# EAGLE schematic PixHawk_Fire_v1.3 (EAGLE 6.6.0)

## Sheet 1 of 9
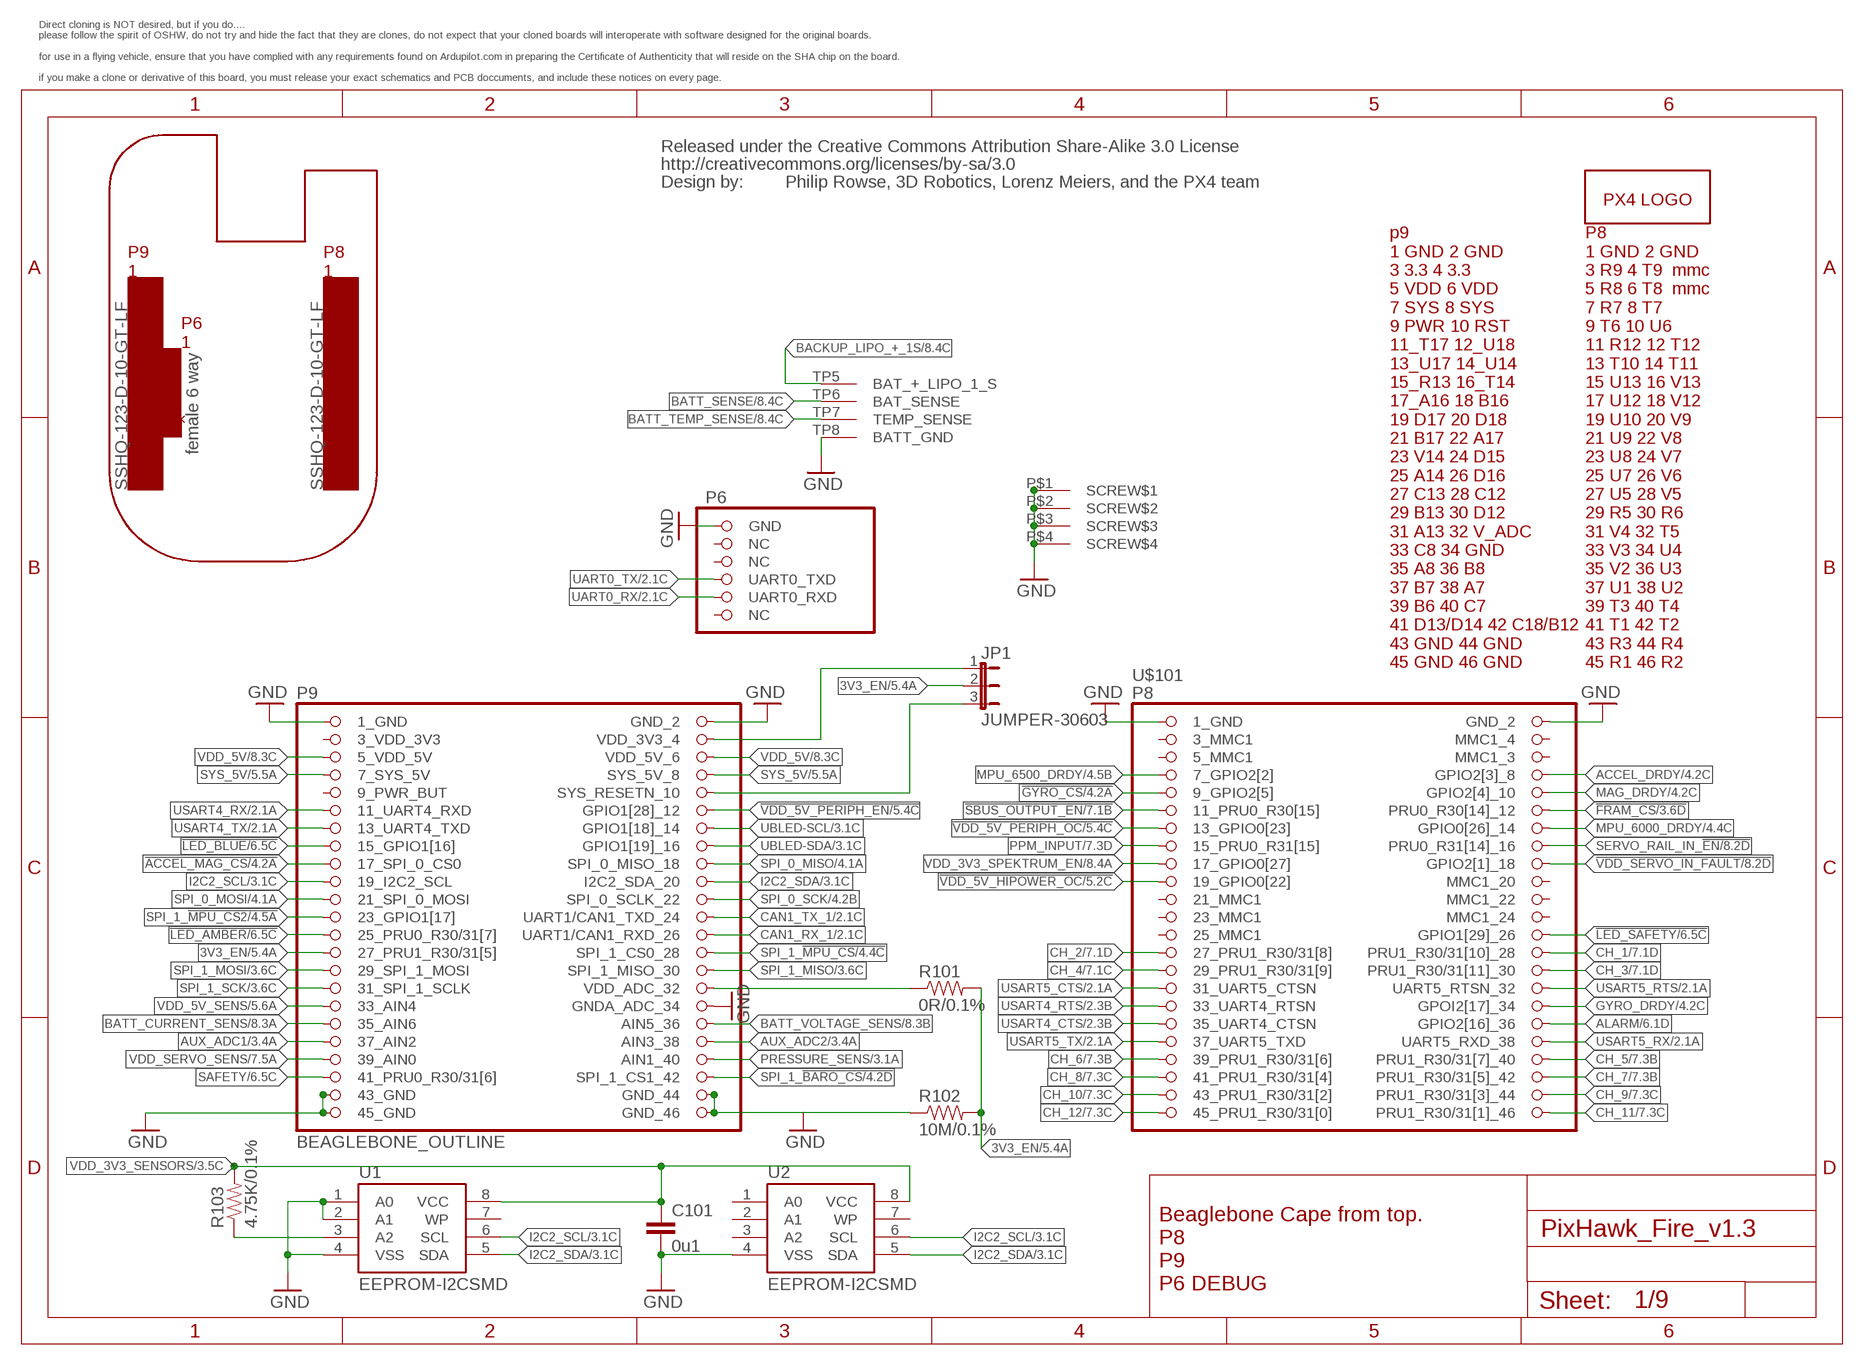
[diagram p0: schematic, sheet 1]
U$16 (NOT-CONNECTED): PARTNO: SSHQ-123-D-10-GT-LF
U$17 (NOT-CONNECTED): PARTNO: SSHQ-123-D-10-GT-LF
U$18 (NOT-CONNECTED): PARTNO: female 6 way

### Parts
C101  0u1  CAP0402  [0402-CAP]
JP1  JUMPER-30603  [SJ_3_0603_PASTE1&2]
R101  0R/0.1%  RESISTOR0402-RES  [0402-RES]
R102  10M/0.1%  RESISTOR0402-RES  [0402-RES]
R103  4.75K/0.1%  RESISTOR0402-RES  [0402-RES]
U1  EEPROM-I2CSMD  [SO08]
U2  EEPROM-I2CSMD  [SO08]
U$1  PX4-LOGO  [PIXHAWK-FIRE-LOGO-30]
U$6  CREATIVE_COMMONS  [CREATIVE_COMMONS]
U$101  BEAGLEBONE_OUTLINE  [BEAGLEBONE_SHIELD]

### Nets
3V3_EN [power]: JP1.2 R101.P$2 R102.P$2 U$101.73(27_PRU1_R30/31[5]) ; also sheet 5
!ACCEL_MAG_CS: U$101.63(17_SPI_0_CS0) ; also sheet 4
!FRAM_CS: U$101.12(PRU0_R30[14]_12) ; also sheet 3
!GYRO_CS: U$101.9(9_GPIO2[5]) ; also sheet 4
!LED_AMBER: U$101.71(25_PRU0_R30/31[7]) ; also sheet 6
!LED_BLUE: U$101.61(15_GPIO1[16]) ; also sheet 6
!LED_SAFETY: U$101.26(GPIO1[29]_26) ; also sheet 6
!SBUS_OUTPUT_EN: U$101.11(11_PRU0_R30[15]) ; also sheet 7
!VDD_5V_HIPOWER_OC: U$101.19(19_GPIO0[22]) ; also sheet 5
!VDD_5V_PERIPH_EN: U$101.58(GPIO1[28]_12) ; also sheet 5
!VDD_5V_PERIPH_OC: U$101.13(13_GPIO0[23]) ; also sheet 5
!VDD_SERVO_IN_FAULT: U$101.18(GPIO2[1]_18) ; also sheet 8
ACCEL_DRDY: U$101.8(GPIO2[3]_8) ; also sheet 4
ALARM: U$101.36(GPIO2[16]_36) ; also sheet 6
AUX_ADC1: U$101.83(37_AIN2) ; also sheet 3
AUX_ADC2: U$101.84(AIN3_38) ; also sheet 3
BACKUP_LIPO_+_1S: U$101.TP5(BAT_+_LIPO_1_S) ; also sheet 8
BATT_CURRENT_SENS: U$101.81(35_AIN6) ; also sheet 8
BATT_SENSE: U$101.TP6(BAT_SENSE) ; also sheet 8
BATT_TEMP_SENSE: U$101.TP7(TEMP_SENSE) ; also sheet 8
BATT_VOLTAGE_SENS: U$101.82(AIN5_36) ; also sheet 8
CH_1: U$101.28(PRU1_R30/31[10]_28) ; also sheet 7
CH_2: U$101.27(27_PRU1_R30/31[8]) ; also sheet 7
CH_3: U$101.30(PRU1_R30/31[11]_30) ; also sheet 7
CH_4: U$101.29(29_PRU1_R30/31[9]) ; also sheet 7
CH_5: U$101.40(PRU1_R30/31[7]_40) ; also sheet 7
CH_6: U$101.39(39_PRU1_R30/31[6]) ; also sheet 7
CH_7: U$101.42(PRU1_R30/31[5]_42) ; also sheet 7
CH_8: U$101.41(41_PRU1_R30/31[4]) ; also sheet 7
CH_9: U$101.44(PRU1_R30/31[3]_44) ; also sheet 7
CH_10: U$101.43(43_PRU1_R30/31[2]) ; also sheet 7
CH_11: U$101.46(PRU1_R30/31[1]_46) ; also sheet 7
CH_12: U$101.45(45_PRU1_R30/31[0]) ; also sheet 7
GND [power]: C101.P$2 R102.P$1 U1.1(A0) U1.2(A1) U1.4(VSS) U2.4(VSS) U$101.1(1_GND) U$101.2(GND_2) U$101.47(1_GND) U$101.48(GND_2) U$101.80(GNDA_ADC_34) U$101.89(43_GND) U$101.90(GND_44) U$101.91(45_GND) U$101.92(GND_46) U$101.93(GND) U$101.P$1(SCREW$1) U$101.P$2(SCREW$2) U$101.P$3(SCREW$3) U$101.P$4(SCREW$4) U$101.TP8(BATT_GND) ; also sheet 2,3,4,5,6,7,8,9
GYRO_DRDY: U$101.34(GPOI2[17]_34) ; also sheet 4
I2C2_SCL: U1.6(SCL) U2.6(SCL) U$101.65(19_I2C2_SCL) ; also sheet 3,4,6
I2C2_SDA: U1.5(SDA) U2.5(SDA) U$101.66(I2C2_SDA_20) ; also sheet 3,4,6
MAG_DRDY: U$101.10(GPIO2[4]_10) ; also sheet 4
MPU_6000_DRDY [power]: U$101.14(GPIO0[26]_14) ; also sheet 4
MPU_6500_DRDY: U$101.7(7_GPIO2[2]) ; also sheet 4
N$43: R103.P$1 U1.3(A2)
N$58: JP1.1 U$101.50(VDD_3V3_4)
N$59: JP1.3 U$101.56(SYS_RESETN_10)
PPM_INPUT: U$101.15(15_PRU0_R31[15]) ; also sheet 7
PRESSURE_SENS: U$101.86(AIN1_40) ; also sheet 3
SAFETY: U$101.87(41_PRU0_R30/31[6]) ; also sheet 6
SERVO_RAIL_IN_!EN: U$101.16(PRU0_R31[14]_16) ; also sheet 8
SPI_0_MISO: U$101.64(SPI_0_MISO_18) ; also sheet 4
SPI_0_MOSI: U$101.67(21_SPI_0_MOSI) ; also sheet 4
SPI_0_SCK: U$101.68(SPI_0_SCLK_22) ; also sheet 4
SPI_1_!BARO_CS: U$101.88(SPI_1_CS1_42) ; also sheet 4
SPI_1_!MPU_CS: U$101.74(SPI_1_CS0_28) ; also sheet 4
SPI_1_!MPU_CS2: U$101.69(23_GPIO1[17]) ; also sheet 4
SPI_1_MISO: U$101.76(SPI_1_MISO_30) ; also sheet 3,4
SPI_1_MOSI: U$101.75(29_SPI_1_MOSI) ; also sheet 3,4
SPI_1_SCK: U$101.77(31_SPI_1_SCLK) ; also sheet 3,4
SYS_5V: U$101.53(7_SYS_5V) U$101.54(SYS_5V_8) ; also sheet 5,7,8,9
UART0_RX: U$101.97(UART0_RXD) ; also sheet 2
UART0_TX: U$101.96(UART0_TXD) ; also sheet 2
UBLED-SCL: U$101.60(GPIO1[18]_14) ; also sheet 3
UBLED-SDA: U$101.62(GPIO1[19]_16) ; also sheet 3
USART4_CTS: U$101.35(35_UART4_CTSN) ; also sheet 2
USART4_RTS: U$101.33(33_UART4_RTSN) ; also sheet 2
USART4_RX: U$101.57(11_UART4_RXD) ; also sheet 2
USART4_TX: U$101.59(13_UART4_TXD) ; also sheet 2
USART5_CTS: U$101.31(31_UART5_CTSN) ; also sheet 2
USART5_RTS: U$101.32(UART5_RTSN_32) ; also sheet 2
USART5_RX: U$101.38(UART5_RXD_38) ; also sheet 2
USART5_TX: U$101.37(37_UART5_TXD) ; also sheet 2
VDD_3V3_SENSORS [power]: C101.P$1 R103.P$2 U1.8(VCC) U2.8(VCC) ; also sheet 3,4,5,9
VDD_3V3_SPEKTRUM_EN: U$101.17(17_GPIO0[27]) ; also sheet 8
VDD_5V: U$101.51(5_VDD_5V) U$101.52(VDD_5V_6) ; also sheet 8
VDD_5V_SENS: U$101.79(33_AIN4) ; also sheet 5
VDD_ADC: R101.P$1 U$101.78(VDD_ADC_32)
VDD_SERVO_SENS: U$101.85(39_AIN0) ; also sheet 7
Unconnected: U1.7(WP) U2.1(A0) U2.2(A1) U2.3(A2) U2.7(WP) U$101.3(3_MMC1) U$101.4(MMC1_4) U$101.5(5_MMC1) U$101.6(MMC1_3) U$101.20(MMC1_20) U$101.21(21_MMC1) U$101.22(MMC1_22) U$101.23(23_MMC1) U$101.24(MMC1_24) U$101.25(25_MMC1) U$101.55(9_PWR_BUT) U$101.70(UART1/CAN1_TXD_24) U$101.72(UART1/CAN1_RXD_26) U$101.94(NC) U$101.95(NC) U$101.98(NC)

### Notes on the sheet
- Direct cloning is NOT desired, but if you do....
  please follow the spirit of OSHW, do not try and hide the fact that they are clones, do not expect that your cloned boards will interoperate with software designed for the original boards.
  
  for use in a flying vehicle, ensure that you have complied with any requirements found on Ardupilot.com in preparing the Certificate of Authenticity that will reside on the SHA chip on the board.
  
  if you make a clone or derivative of this board, you must release your exact schematics and PCB doccuments, and include these notices on every page.
- Philip Rowse, 3D Robotics, Lorenz Meiers, and the PX4 team
- Beaglebone Cape from top.
  P8
  P9
  P6 DEBUG

## Sheet 2 of 9
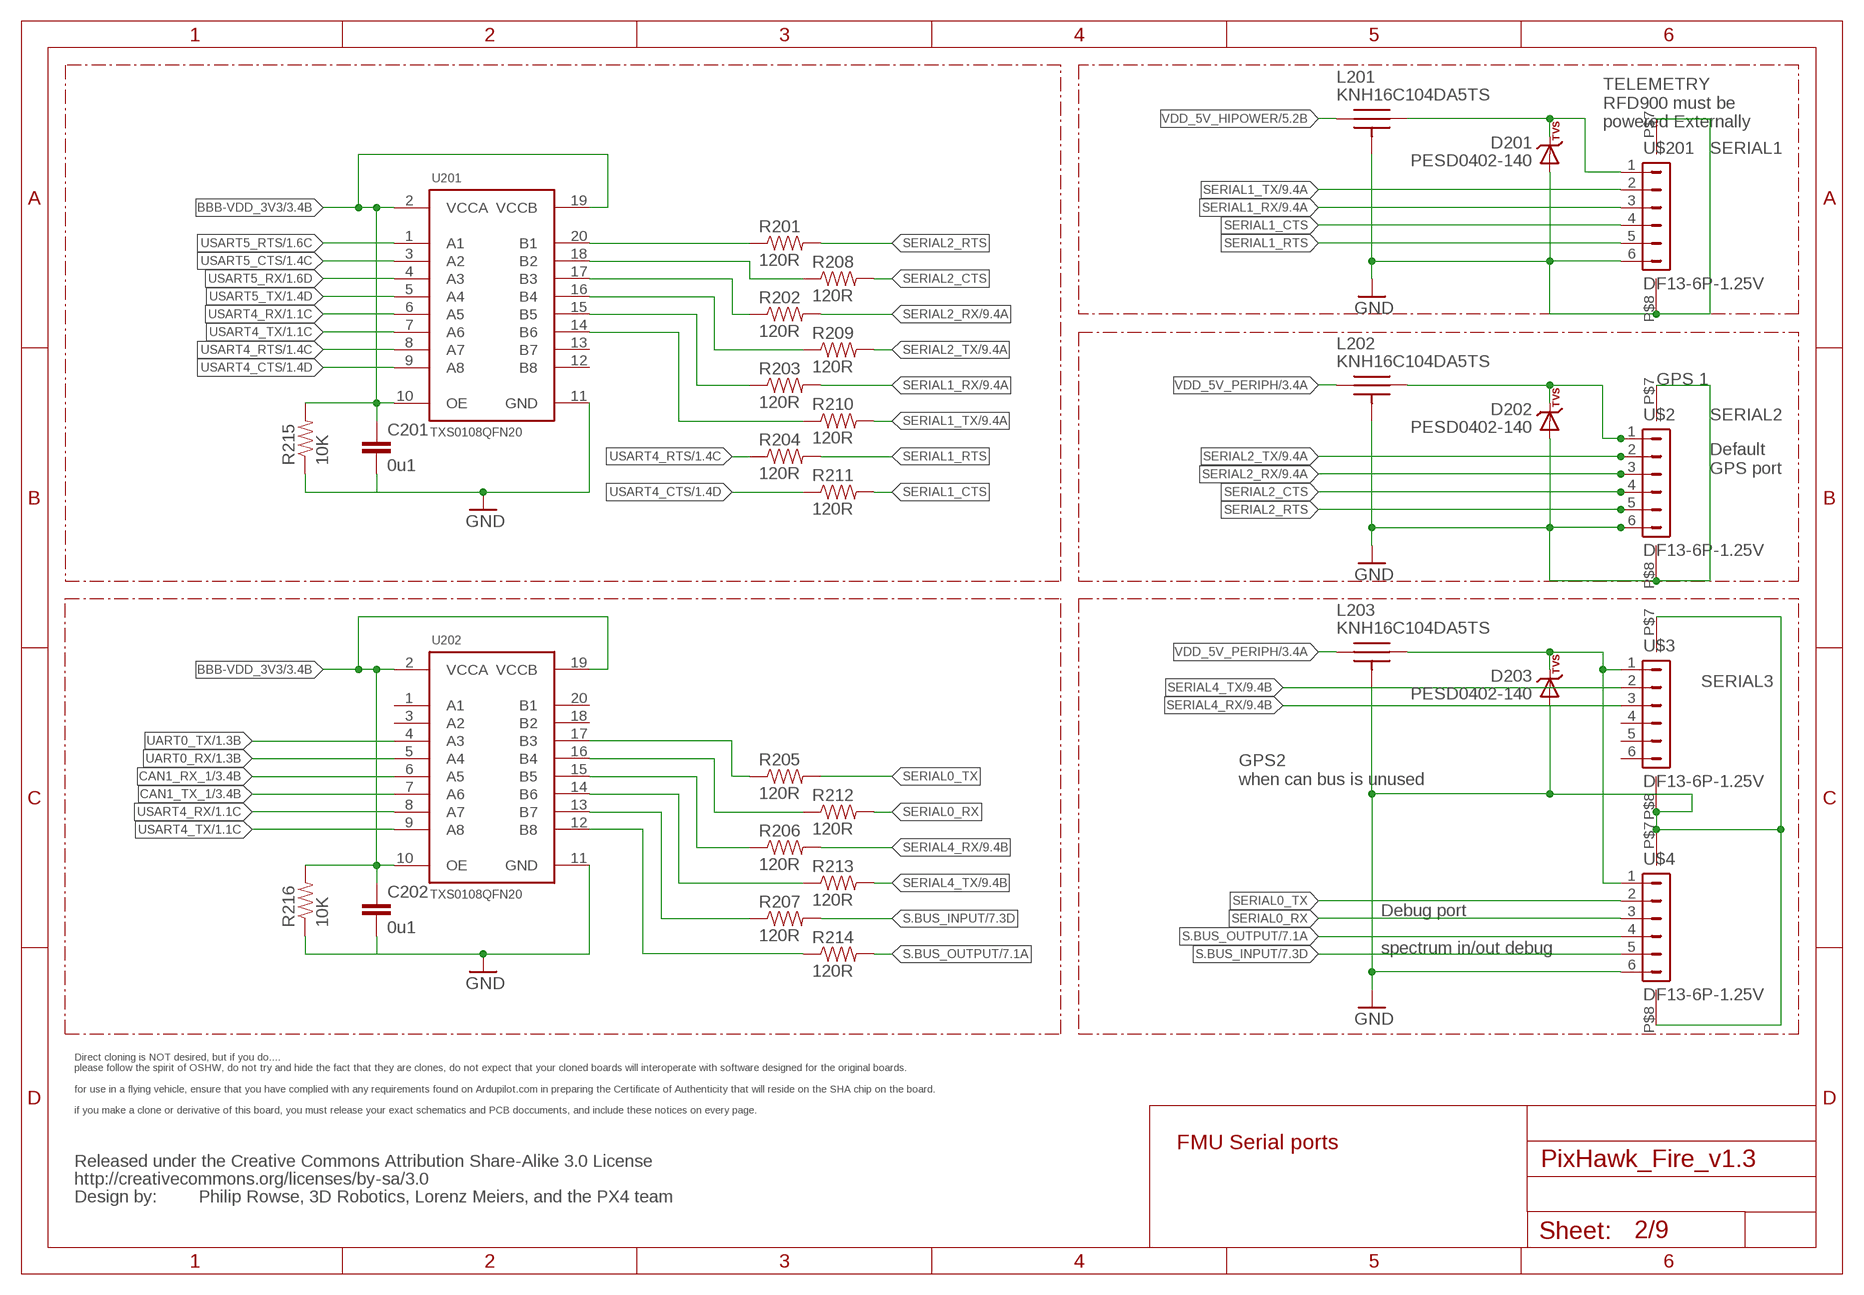
[diagram p1: schematic, sheet 2]

### Parts
C201  0u1  CAP0402  [0402-CAP]
C202  0u1  CAP0402  [0402-CAP]
D201  PESD0402-140  DIODE-TVS  [0402-TVS]
D202  PESD0402-140  DIODE-TVS  [0402-TVS]
D203  PESD0402-140  DIODE-TVS  [0402-TVS]
L201  KNH16C104DA5TS  [KYOCERA-KNH16-DA]
L202  KNH16C104DA5TS  [KYOCERA-KNH16-DA]
L203  KNH16C104DA5TS  [KYOCERA-KNH16-DA]
R201  120R  RESISTOR0402-RES  [0402-RES]
R202  120R  RESISTOR0402-RES  [0402-RES]
R203  120R  RESISTOR0402-RES  [0402-RES]
R204  120R  RESISTOR0402-RES  [0402-RES]
R205  120R  RESISTOR0402-RES  [0402-RES]
R206  120R  RESISTOR0402-RES  [0402-RES]
R207  120R  RESISTOR0402-RES  [0402-RES]
R208  120R  RESISTOR0402-RES  [0402-RES]
R209  120R  RESISTOR0402-RES  [0402-RES]
R210  120R  RESISTOR0402-RES  [0402-RES]
R211  120R  RESISTOR0402-RES  [0402-RES]
R212  120R  RESISTOR0402-RES  [0402-RES]
R213  120R  RESISTOR0402-RES  [0402-RES]
R214  120R  RESISTOR0402-RES  [0402-RES]
R215  10K  RESISTOR0402-RES  [0402-RES]
R216  10K  RESISTOR0402-RES  [0402-RES]
U201  TXS0108QFN20  [QFN20-RGY]
U202  TXS0108QFN20  [QFN20-RGY]
U$2  DF13-6P-1.25V  [DF13C-6P-1.25V]
U$3  DF13-6P-1.25V  [DF13C-6P-1.25V]
U$4  DF13-6P-1.25V  [DF13C-6P-1.25V]
U$5  CREATIVE_COMMONS  [CREATIVE_COMMONS]
U$201  DF13-6P-1.25V  [DF13C-6P-1.25V]

### Nets
BBB-VDD_3V3 [power]: C201.P$1 C202.P$1 R215.P$2 R216.P$2 U201.2(VCCA) U201.10(OE) U201.19(VCCB) U202.2(VCCA) U202.10(OE) U202.19(VCCB) ; also sheet 3,5,6,7,9
CAN1_RX_1: U202.6(A5) ; also sheet 1,3
CAN1_TX_1: U202.7(A6) ; also sheet 1,3
GND [power]: C201.P$2 C202.P$2 D201.A D202.A D203.A L201.P$3 L201.P$4 L201.P$5 L202.P$3 L202.P$4 L202.P$5 L203.P$3 L203.P$4 L203.P$5 R215.P$1 R216.P$1 U201.11(GND) U202.11(GND) U$2.6 U$2.P$7 U$2.P$8 U$3.P$7 U$3.P$8 U$4.6 U$4.P$7 U$4.P$8 U$201.6 U$201.P$7 U$201.P$8 ; also sheet 1,3,4,5,6,7,8,9
N$5 [power]: D201.C L201.P$2 U$201.1
N$6: R205.P$1 U202.17(B3)
N$7: R212.P$1 U202.16(B4)
N$49: R208.P$1 U201.18(B2)
N$53: R201.P$1 U201.20(B1)
N$83: R202.P$1 U201.17(B3)
N$84: R209.P$1 U201.16(B4)
N$85: R203.P$1 U201.15(B5)
N$86: R210.P$1 U201.14(B6)
N$89: R207.P$1 U202.13(B7)
N$90: R214.P$1 U202.12(B8)
N$93: R206.P$1 U202.15(B5)
N$94: R213.P$1 U202.14(B6)
N$100 [power]: D203.C L203.P$2 U$3.1 U$4.1
N$101 [power]: D202.C L202.P$2 U$2.1
S.BUS_INPUT: R207.P$2 U$4.5 ; also sheet 7,9
S.BUS_OUTPUT: R214.P$2 U$4.4 ; also sheet 7,9
SERIAL0_RX: R212.P$2 U$4.3
SERIAL0_TX: R205.P$2 U$4.2
SERIAL1_CTS: R211.P$2 U$201.4
SERIAL1_RTS: R204.P$2 U$201.5
SERIAL1_RX: R203.P$2 U$201.3 ; also sheet 9
SERIAL1_TX: R210.P$2 U$201.2 ; also sheet 9
SERIAL2_CTS: R208.P$2 U$2.4
SERIAL2_RTS: R201.P$2 U$2.5
SERIAL2_RX: R202.P$2 U$2.3 ; also sheet 9
SERIAL2_TX: R209.P$2 U$2.2 ; also sheet 9
SERIAL4_RX: R206.P$2 U$3.3 ; also sheet 9
SERIAL4_TX: R213.P$2 U$3.2 ; also sheet 9
UART0_RX: U202.5(A4) ; also sheet 1
UART0_TX: U202.4(A3) ; also sheet 1
USART4_CTS: R211.P$1 U201.9(A8) ; also sheet 1
USART4_RTS: R204.P$1 U201.8(A7) ; also sheet 1
USART4_RX: U201.6(A5) U202.8(A7) ; also sheet 1
USART4_TX: U201.7(A6) U202.9(A8) ; also sheet 1
USART5_CTS: U201.3(A2) ; also sheet 1
USART5_RTS: U201.1(A1) ; also sheet 1
USART5_RX: U201.4(A3) ; also sheet 1
USART5_TX: U201.5(A4) ; also sheet 1
VDD_5V_HIPOWER [power]: L201.P$1 ; also sheet 5
VDD_5V_PERIPH [power]: L202.P$1 L203.P$1 ; also sheet 3,5,6
Unconnected: U201.12(B8) U201.13(B7) U202.1(A1) U202.3(A2) U202.18(B2) U202.20(B1) U$3.4 U$3.5 U$3.6

### Notes on the sheet
- TELEMETRY
  RFD900 must be
  powered Externally
- SERIAL1
- GPS 1
- SERIAL2
- Default 
  GPS port
- SERIAL3
- GPS2
  when can bus is unused
- Debug port
  
  spectrum in/out debug
- Direct cloning is NOT desired, but if you do....
  please follow the spirit of OSHW, do not try and hide the fact that they are clones, do not expect that your cloned boards will interoperate with software designed for the original boards.
  
  for use in a flying vehicle, ensure that you have complied with any requirements found on Ardupilot.com in preparing the Certificate of Authenticity that will reside on the SHA chip on the board.
  
  if you make a clone or derivative of this board, you must release your exact schematics and PCB doccuments, and include these notices on every page.
- FMU Serial ports
- Philip Rowse, 3D Robotics, Lorenz Meiers, and the PX4 team

## Sheet 3 of 9
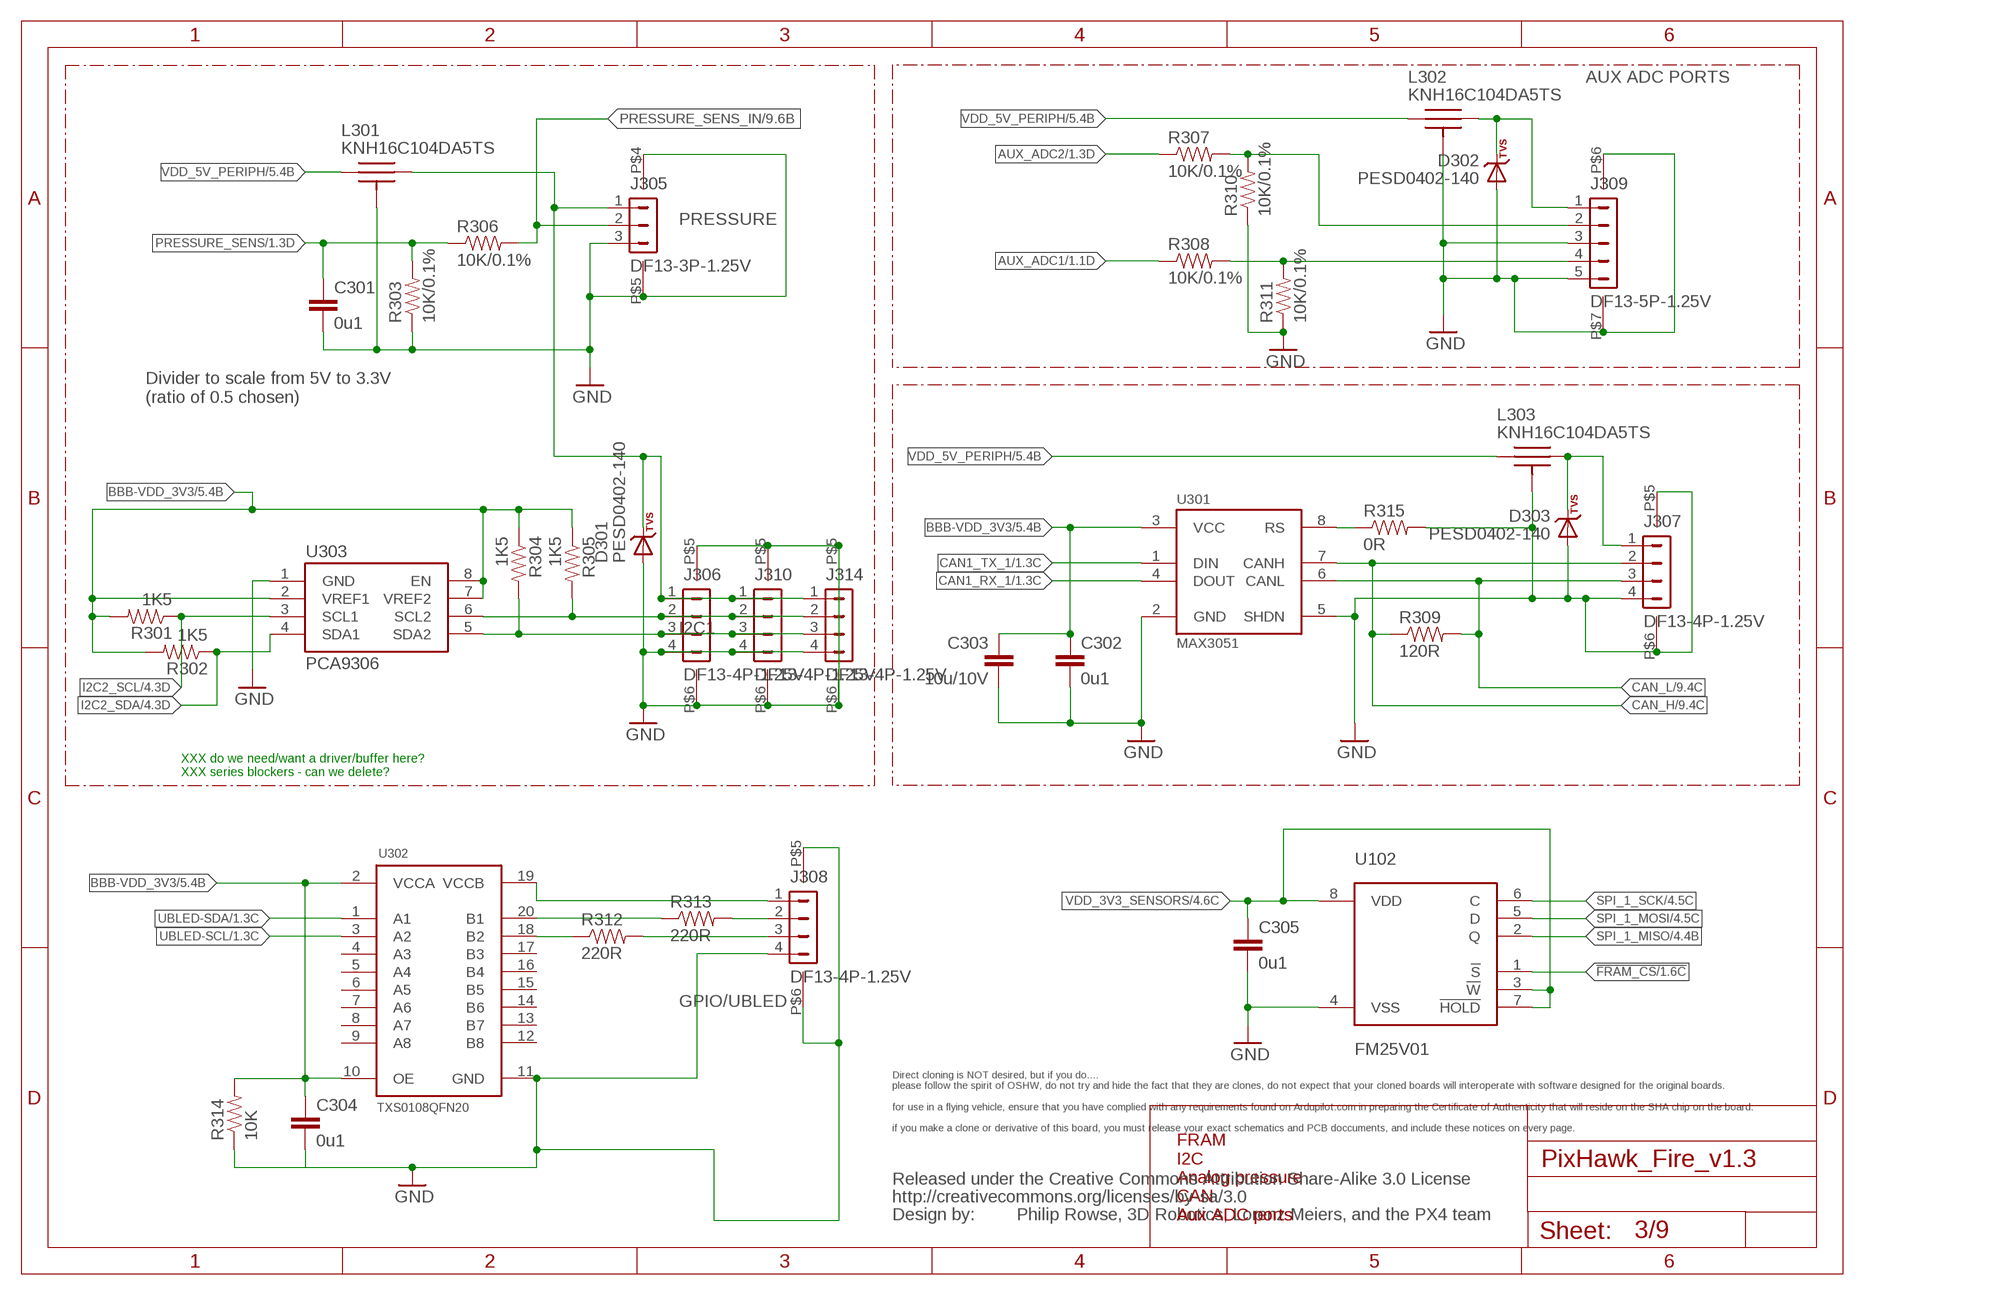
[diagram p2: schematic, sheet 3]

### Parts
C301  0u1  CAP0402  [0402-CAP]
C302  0u1  CAP0402  [0402-CAP]
C303  10u/10V  CAP0805  [0805-CAP]
C304  0u1  CAP0402  [0402-CAP]
C305  0u1  CAP0402  [0402-CAP]
D301  PESD0402-140  DIODE-TVS  [0402-TVS]
D302  PESD0402-140  DIODE-TVS  [0402-TVS]
D303  PESD0402-140  DIODE-TVS  [0402-TVS]
J305  DF13-3P-1.25V  [DF13C-3P-1.25V]
J306  DF13-4P-1.25V  [DF13C-4P-1.25V]
J307  DF13-4P-1.25V  [DF13C-4P-1.25V]
J308  DF13-4P-1.25V  [DF13C-4P-1.25V]
J309  DF13-5P-1.25V  [DF13C-5P-1.25V]
J310  DF13-4P-1.25V  [DF13C-4P-1.25V]
J314  DF13-4P-1.25V  [DF13C-4P-1.25V]
L301  KNH16C104DA5TS  [KYOCERA-KNH16-DA]
L302  KNH16C104DA5TS  [KYOCERA-KNH16-DA]
L303  KNH16C104DA5TS  [KYOCERA-KNH16-DA]
R301  1K5  RESISTOR0402-RES  [0402-RES]
R302  1K5  RESISTOR0402-RES  [0402-RES]
R303  10K/0.1%  RESISTOR0402-RES  [0402-RES]
R304  1K5  RESISTOR0402-RES  [0402-RES]
R305  1K5  RESISTOR0402-RES  [0402-RES]
R306  10K/0.1%  RESISTOR0402-RES  [0402-RES]
R307  10K/0.1%  RESISTOR0402-RES  [0402-RES]
R308  10K/0.1%  RESISTOR0402-RES  [0402-RES]
R309  120R  RESISTOR0402-RES  [0402-RES]
R310  10K/0.1%  RESISTOR0402-RES  [0402-RES]
R311  10K/0.1%  RESISTOR0402-RES  [0402-RES]
R312  220R  RESISTOR0402-RES  [0402-RES]
R313  220R  RESISTOR0402-RES  [0402-RES]
R314  10K  RESISTOR0402-RES  [0402-RES]
R315  0R  RESISTOR0402-RES  [0402-RES]
U102  FM25V01  [SO08]
U301  MAX3051  MAX3051MAX3051EKA  [SOT23-8]
U302  TXS0108QFN20  [QFN20-RGY]
U303  PCA9306  [PCA9306]
U$7  CREATIVE_COMMONS  [CREATIVE_COMMONS]

### Nets
!FRAM_CS: U102.1(!S) ; also sheet 1
AUX_ADC1: R308.P$1 ; also sheet 1
AUX_ADC2: R307.P$1 ; also sheet 1
BBB-VDD_3V3 [power]: C302.P$1 C303.P$1 C304.P$1 R301.P$2 R302.P$2 R304.P$1 R305.P$1 R314.P$2 U301.3(VCC) U302.2(VCCA) U302.10(OE) U303.2(VREF1) U303.7(VREF2) U303.8(EN) ; also sheet 2,5,6,7,9
CAN1_RX_1: U301.4(DOUT) ; also sheet 1,2
CAN1_TX_1: U301.1(DIN) ; also sheet 1,2
CAN_H: J307.2 R309.P$1 U301.7(CANH) ; also sheet 9
CAN_L: J307.3 R309.P$2 U301.6(CANL) ; also sheet 9
FMU_AUX_ADC1_PROT: J309.4 R308.P$2 R311.P$2
FMU_AUX_ADC2_PROT: J309.2 R307.P$2 R310.P$2
GND [power]: C301.P$2 C302.P$2 C303.P$2 C304.P$2 C305.P$2 D301.A D302.A D303.A J305.3 J305.P$4 J305.P$5 J306.4 J306.P$5 J306.P$6 J307.4 J307.P$5 J307.P$6 J308.4 J308.P$5 J308.P$6 J309.3 J309.5 J309.P$6 J309.P$7 J310.4 J310.P$5 J310.P$6 J314.4 J314.P$5 J314.P$6 L301.P$3 L301.P$4 L301.P$5 L302.P$3 L302.P$4 L302.P$5 L303.P$3 L303.P$4 L303.P$5 R303.P$1 R310.P$1 R311.P$1 R314.P$1 R315.P$2 U102.4(VSS) U301.2(GND) U301.5(SHDN) U302.11(GND) U303.1(GND) ; also sheet 1,2,4,5,6,7,8,9
I2C2_SCL: R301.P$1 U303.3(SCL1) ; also sheet 1,4,6
I2C2_SDA: R302.P$1 U303.4(SDA1) ; also sheet 1,4,6
N$17: R313.P$1 U302.20(B1)
N$33: J306.2 J310.2 J314.2 R305.P$2 U303.6(SCL2)
N$37: J306.3 J310.3 J314.3 R304.P$2 U303.5(SDA2)
N$38: R312.P$1 U302.18(B2)
N$42 [power]: D301.C J305.1 J306.1 J310.1 J314.1 L301.P$2
N$44: J308.3 R312.P$2
N$45: J308.2 R313.P$2
N$47: J308.1 U302.19(VCCB)
N$48 [power]: D303.C J307.1 L303.P$2
N$55 [power]: R315.P$1 U301.8(RS)
N$98 [power]: D302.C J309.1 L302.P$2
PRESSURE_SENS: C301.P$1 R303.P$2 R306.P$1 ; also sheet 1
PRESSURE_SENS_IN: J305.2 R306.P$2 ; also sheet 9
SPI_1_MISO: U102.2(Q) ; also sheet 1,4
SPI_1_MOSI: U102.5(D) ; also sheet 1,4
SPI_1_SCK: U102.6(C) ; also sheet 1,4
UBLED-SCL: U302.3(A2) ; also sheet 1
UBLED-SDA: U302.1(A1) ; also sheet 1
VDD_3V3_SENSORS [power]: C305.P$1 U102.3(!W) U102.7(!HOLD) U102.8(VDD) ; also sheet 1,4,5,9
VDD_5V_PERIPH [power]: L301.P$1 L302.P$1 L303.P$1 ; also sheet 2,5,6
Unconnected: U302.4(A3) U302.5(A4) U302.6(A5) U302.7(A6) U302.8(A7) U302.9(A8) U302.12(B8) U302.13(B7) U302.14(B6) U302.15(B5) U302.16(B4) U302.17(B3)

### Notes on the sheet
- AUX ADC PORTS
- PRESSURE
- Divider to scale from 5V to 3.3V
  (ratio of 0.5 chosen)
- I2C1
- XXX do we need/want a driver/buffer here?
  XXX series blockers - can we delete?
- GPIO/UBLED
- Direct cloning is NOT desired, but if you do....
  please follow the spirit of OSHW, do not try and hide the fact that they are clones, do not expect that your cloned boards will interoperate with software designed for the original boards.
  
  for use in a flying vehicle, ensure that you have complied with any requirements found on Ardupilot.com in preparing the Certificate of Authenticity that will reside on the SHA chip on the board.
  
  if you make a clone or derivative of this board, you must release your exact schematics and PCB doccuments, and include these notices on every page.
- Philip Rowse, 3D Robotics, Lorenz Meiers, and the PX4 team
- FRAM
  I2C
  Analog pressure
  CAN
  Aux ADC ports

## Sheet 4 of 9
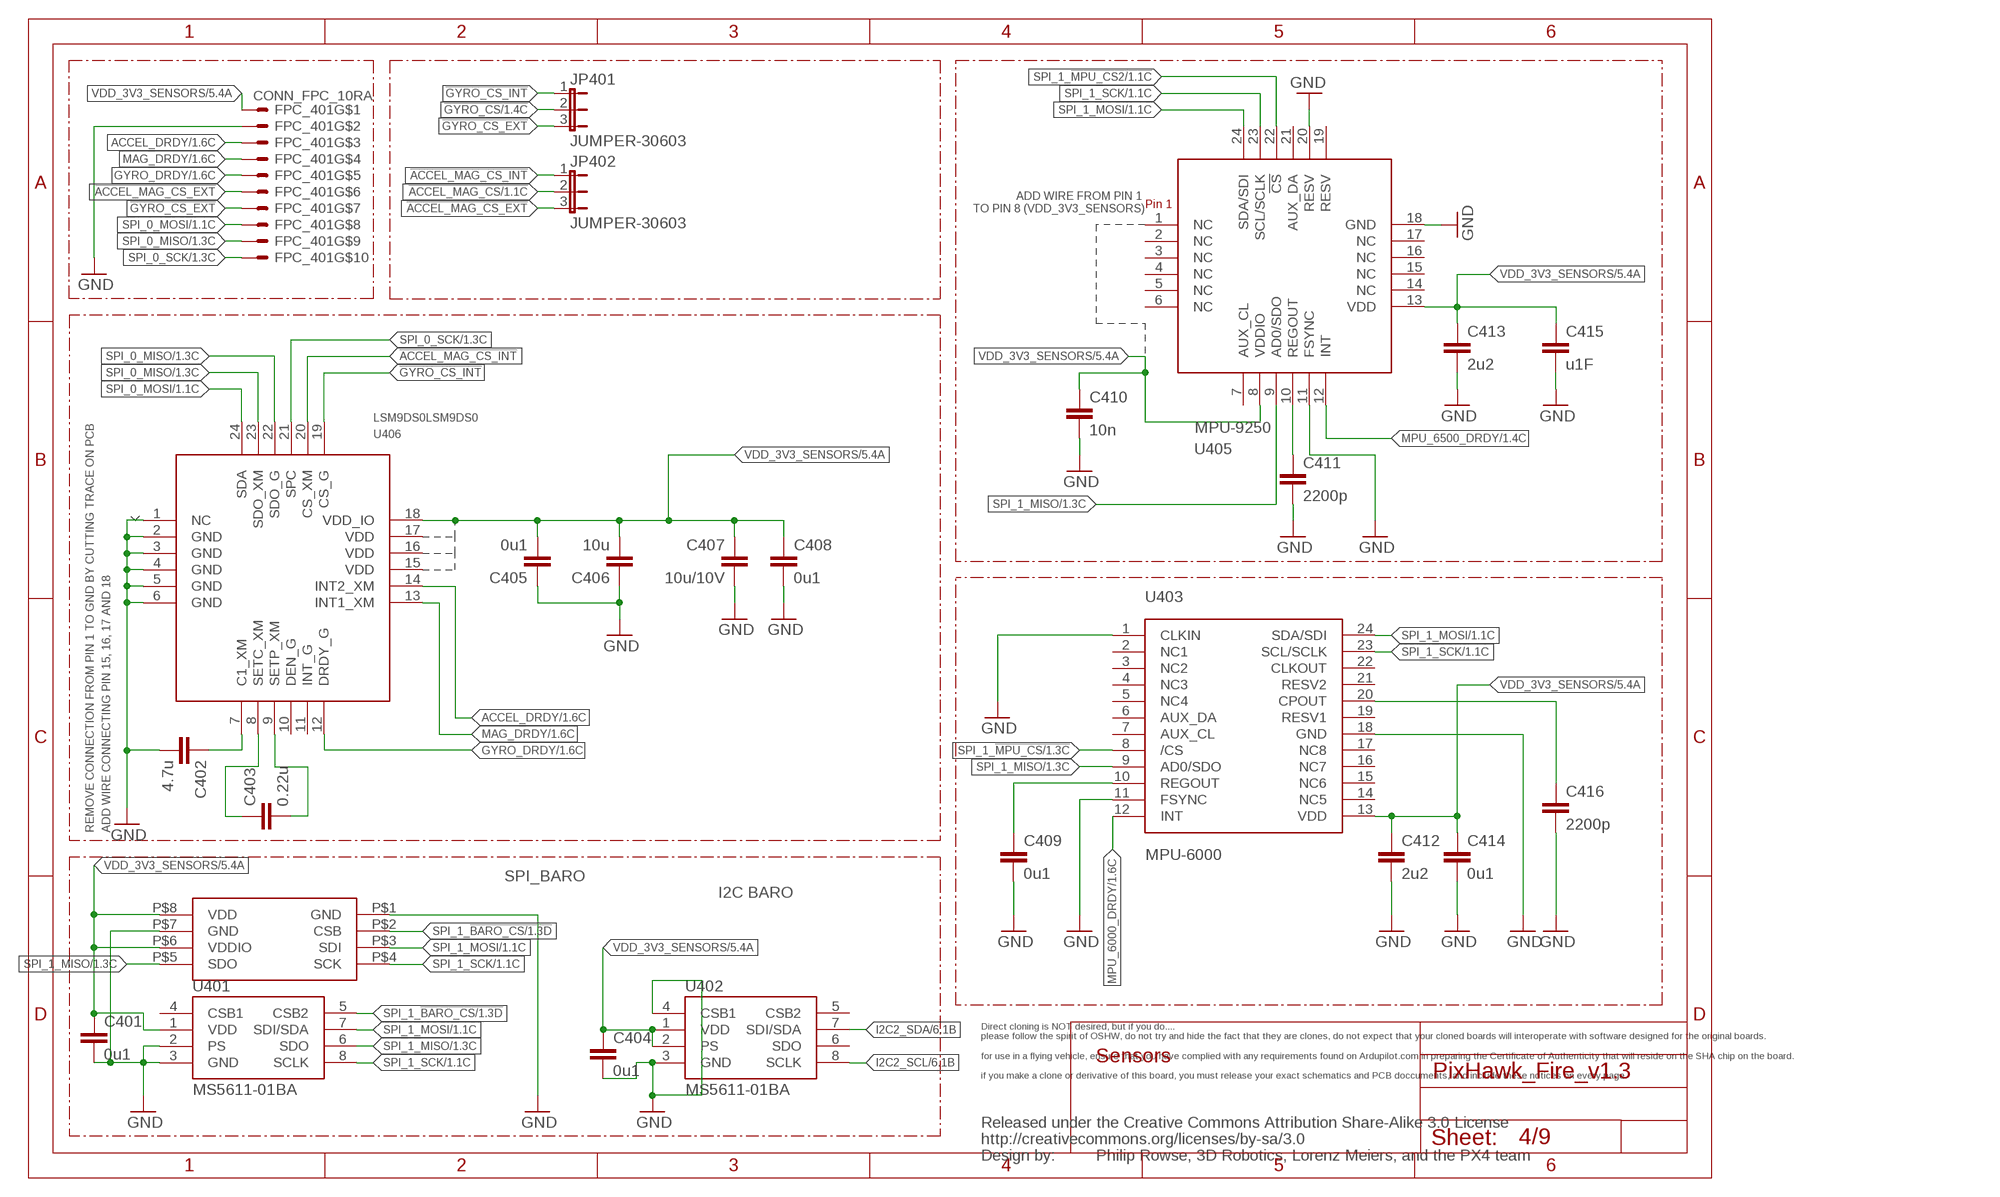
[diagram p3: schematic, sheet 4]

### Parts
C401  0u1  CAP0402  [0402-CAP]
C402  4.7u  CAP0603  [0603-CAP]
C403  0.22u  CAP0603  [0603-CAP]
C404  0u1  CAP0402  [0402-CAP]
C405  0u1  CAP0603  [0603-CAP]
C406  10u  CAP0603  [0603-CAP]
C407  10u/10V  CAP0805  [0805-CAP]
C408  0u1  CAP0402  [0402-CAP]
C409  0u1  CAP0603  [0603-CAP]
C410  10n  CAP0603  [0603-CAP]
C411  2200p  CAP0603  [0603-CAP]
C412  2u2  CAP0603  [0603-CAP]
C413  2u2  CAP0603  [0603-CAP]
C414  0u1  CAP0402  [0402-CAP]
C415  u1F  CAP0402  [0402-CAP]
C416  2200p  CAP0603  [0603-CAP]
FPC_401  CONN_FPC_10RA  [51281-1094]
JP401  JUMPER-30603  [SJ_3_0603_PASTE1&2]
JP402  JUMPER-30603  [SJ_3_0603_PASTE1&2]
U401  MS5611-01BA  [MS5611-01BA]
U402  MS5611-01BA  [MS5611-01BA]
U403  MPU-6000  [QFN-24]
U405  MPU-9250  MPU-6500  [MPU-6500]
U406  LSM9DS0LSM9DS0  [LSM9DS0]
U407  BMP280_PRELIM  [BMP280_PRELIM]
U$8  CREATIVE_COMMONS  [CREATIVE_COMMONS]

### Nets
!ACCEL_MAG_CS: JP402.2 ; also sheet 1
!ACCEL_MAG_CS_EXT: FPC_401.6 JP402.3
!ACCEL_MAG_CS_INT: JP402.1 U406.20(CS_XM)
!GYRO_CS: JP401.2 ; also sheet 1
!GYRO_CS_EXT: FPC_401.7 JP401.3
!GYRO_CS_INT: JP401.1 U406.19(CS_G)
ACCEL_DRDY: FPC_401.3 U406.14(INT2_XM) ; also sheet 1
GND [power]: C401.P$2 C402.P$2 C404.P$2 C405.P$1 C406.P$1 C407.P$2 C408.P$2 C409.P$2 C410.P$2 C411.P$2 C412.P$2 C413.P$2 C414.P$2 C415.P$2 C416.P$2 FPC_401.2 U401.2(PS) U401.3(GND) U402.3(GND) U402.4(CSB1) U403.1(CLKIN) U403.11(FSYNC) U403.18(GND) U405.11(FSYNC) U405.18(GND) U405.20(RESV) U406.1(NC) U406.2(GND) U406.3(GND) U406.4(GND) U406.5(GND) U406.6(GND) U407.P$1(GND) U407.P$7(GND) ; also sheet 1,2,3,5,6,7,8,9
GYRO_DRDY: FPC_401.5 U406.12(DRDY_G) ; also sheet 1
I2C2_SCL: U402.8(SCLK) ; also sheet 1,3,6
I2C2_SDA: U402.7(SDI/SDA) ; also sheet 1,3,6
MAG_DRDY: FPC_401.4 U406.13(INT1_XM) ; also sheet 1
MPU_6000_DRDY [power]: U403.12(INT) ; also sheet 1
MPU_6500_DRDY: U405.12(INT) ; also sheet 1
N$8: C402.P$1 U406.7(C1_XM)
N$14: C403.P$2 U406.9(SETP_XM)
N$15: C411.P$1 U405.10(REGOUT)
N$16: C403.P$1 U406.8(SETC_XM)
N$50: C409.P$1 U403.10(REGOUT)
N$51: C416.P$1 U403.20(CPOUT)
SPI_0_MISO: FPC_401.9 U406.22(SDO_G) U406.23(SDO_XM) ; also sheet 1
SPI_0_MOSI: FPC_401.8 U406.24(SDA) ; also sheet 1
SPI_0_SCK: FPC_401.10 U406.21(SPC) ; also sheet 1
SPI_1_!BARO_CS: U401.5(CSB2) U407.P$2(CSB) ; also sheet 1
SPI_1_!MPU_CS: U403.8(/CS) ; also sheet 1
SPI_1_!MPU_CS2: U405.22(!CS) ; also sheet 1
SPI_1_MISO: U401.6(SDO) U403.9(AD0/SDO) U405.9(AD0/SDO) U407.P$5(SDO) ; also sheet 1,3
SPI_1_MOSI: U401.7(SDI/SDA) U403.24(SDA/SDI) U405.24(SDA/SDI) U407.P$3(SDI) ; also sheet 1,3
SPI_1_SCK: U401.8(SCLK) U403.23(SCL/SCLK) U405.23(SCL/SCLK) U407.P$4(SCK) ; also sheet 1,3
VDD_3V3_SENSORS [power]: C401.P$1 C404.P$1 C405.P$2 C406.P$2 C407.P$1 C408.P$1 C410.P$1 C412.P$1 C413.P$1 C414.P$1 C415.P$1 FPC_401.1 U401.1(VDD) U402.1(VDD) U402.2(PS) U403.13(VDD) U405.8(VDDIO) U405.13(VDD) U406.18(VDD_IO) U407.P$6(VDDIO) U407.P$8(VDD) ; also sheet 1,3,5,9
Unconnected: U401.4(CSB1) U402.5(CSB2) U402.6(SDO) U403.2(NC1) U403.3(NC2) U403.4(NC3) U403.5(NC4) U403.6(AUX_DA) U403.7(AUX_CL) U403.14(NC5) U403.15(NC6) U403.16(NC7) U403.17(NC8) U403.19(RESV1) U403.21(RESV2) U403.22(CLKOUT) U405.1(NC) U405.2(NC) U405.3(NC) U405.4(NC) U405.5(NC) U405.6(NC) U405.7(AUX_CL) U405.14(NC) U405.15(NC) U405.16(NC) U405.17(NC) U405.19(RESV) U405.21(AUX_DA) U406.10(DEN_G) U406.11(INT_G) U406.15(VDD) U406.16(VDD) U406.17(VDD)

### Notes on the sheet
- ADD WIRE FROM PIN 1 
  TO PIN 8 (VDD_3V3_SENSORS)
- REMOVE CONNECTION FROM PIN 1 TO GND BY CUTTING TRACE ON PCB | ADD WIRE CONNECTING PIN 15, 16, 17 AND 18
- SPI_BARO
- I2C BARO
- Sensors
- Direct cloning is NOT desired, but if you do....
  please follow the spirit of OSHW, do not try and hide the fact that they are clones, do not expect that your cloned boards will interoperate with software designed for the original boards.
  
  for use in a flying vehicle, ensure that you have complied with any requirements found on Ardupilot.com in preparing the Certificate of Authenticity that will reside on the SHA chip on the board.
  
  if you make a clone or derivative of this board, you must release your exact schematics and PCB doccuments, and include these notices on every page.
- Philip Rowse, 3D Robotics, Lorenz Meiers, and the PX4 team

## Sheet 5 of 9
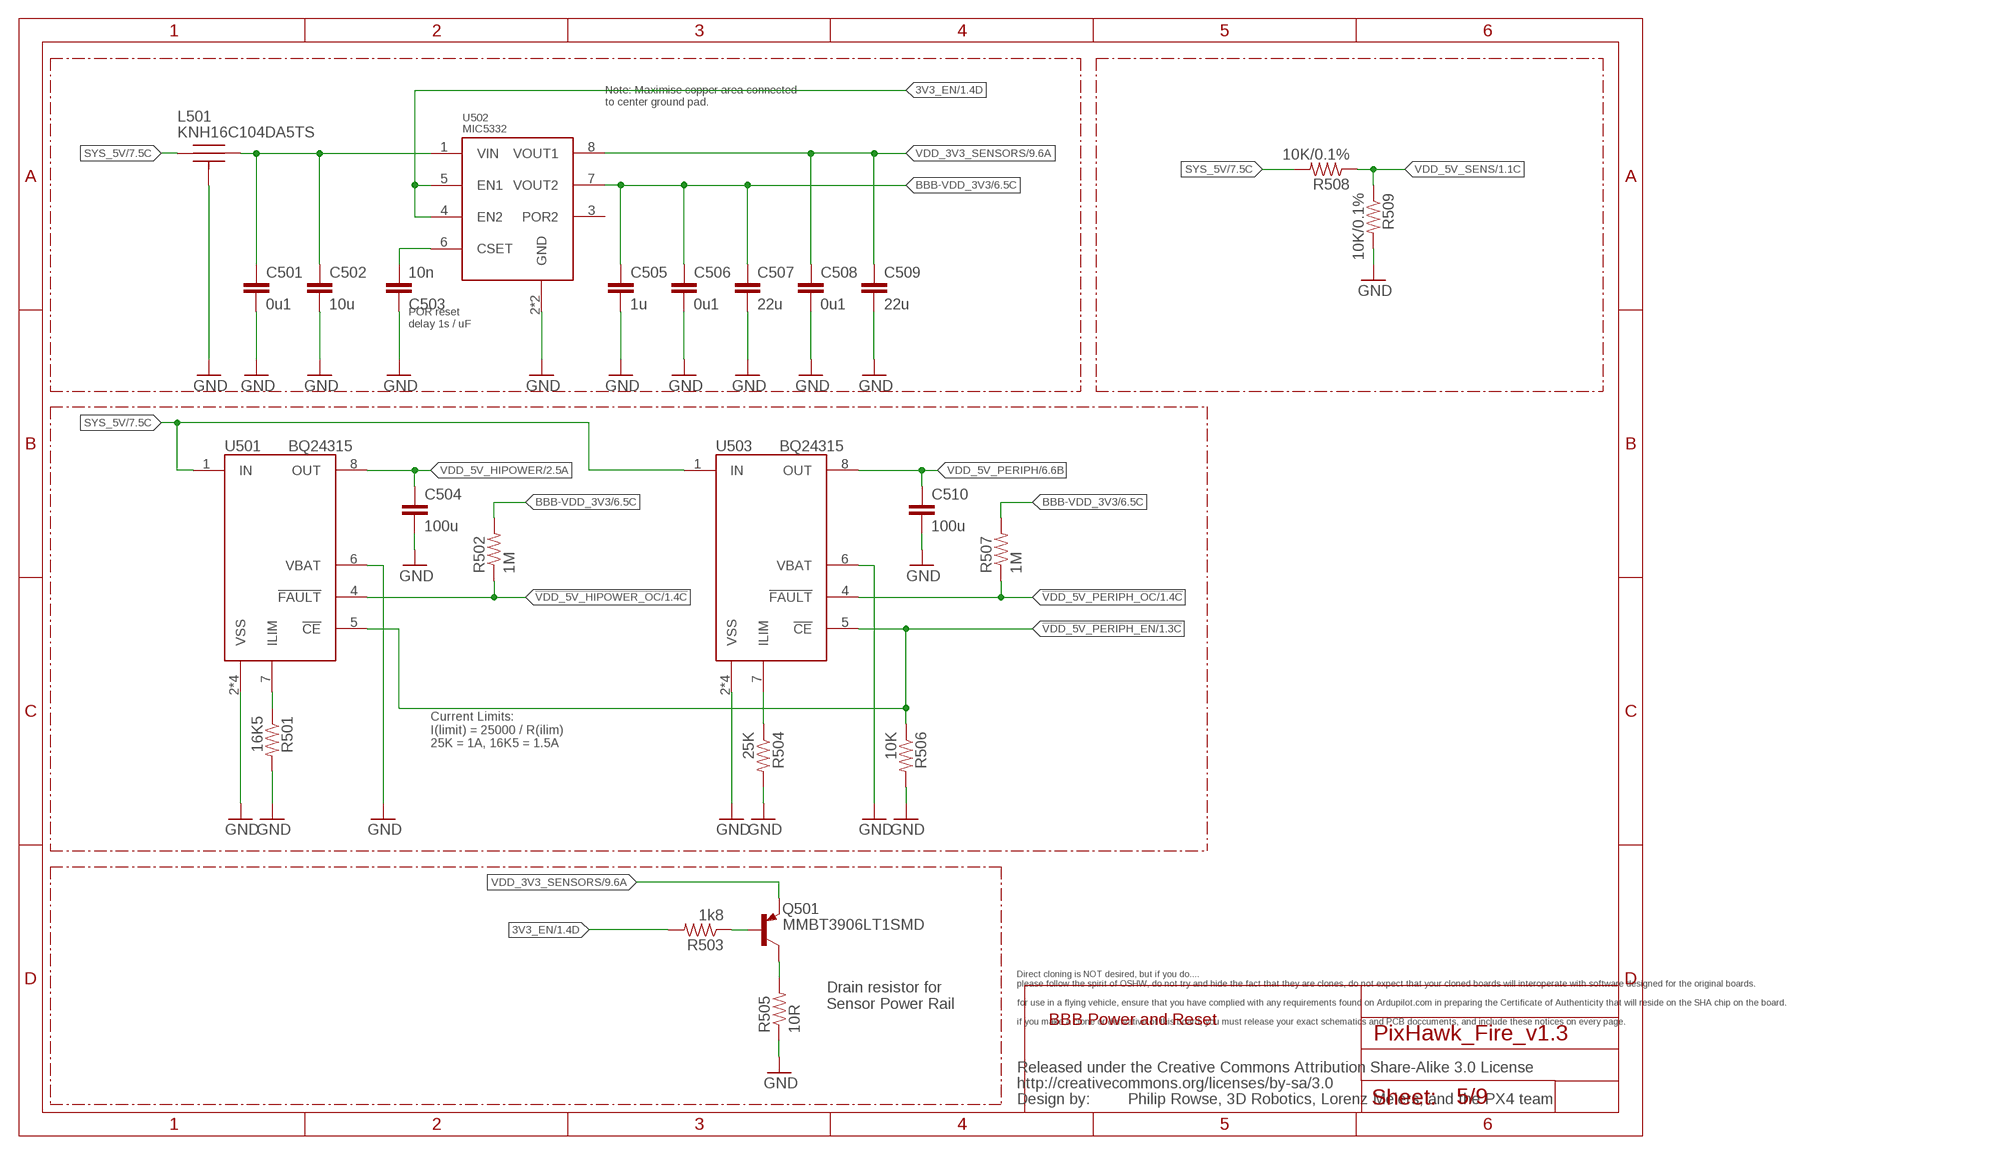
[diagram p4: schematic, sheet 5]

### Parts
C501  0u1  CAP0402  [0402-CAP]
C502  10u  CAP0805  [0805-CAP]
C503  10n  CAP0402  [0402-CAP]
C504  100u  CAP1206  [1206-CAP]
C505  1u  CAP0603  [0603-CAP]
C506  0u1  CAP0402  [0402-CAP]
C507  22u  CAP0805  [0805-CAP]
C508  0u1  CAP0402  [0402-CAP]
C509  22u  CAP0805  [0805-CAP]
C510  100u  CAP1206  [1206-CAP]
L501  KNH16C104DA5TS  [KYOCERA-KNH16-DA]
Q501  MMBT3906LT1SMD  [SOT23-BEC]
R501  16K5  RESISTOR0402-RES  [0402-RES]
R502  1M  RESISTOR0402-RES  [0402-RES]
R503  1k8  RESISTOR0402-RES  [0402-RES]
R504  25K  RESISTOR0402-RES  [0402-RES]
R505  10R  RESISTOR0603-RES  [0603-RES]
R506  10K  RESISTOR0402-RES  [0402-RES]
R507  1M  RESISTOR0402-RES  [0402-RES]
R508  10K/0.1%  RESISTOR0402-RES  [0402-RES]
R509  10K/0.1%  RESISTOR0402-RES  [0402-RES]
U501  BQ24315  [QFN8-DSG]
U502  MIC5332  [MLF-8-EPAD]
U503  BQ24315  [QFN8-DSG]
U$9  CREATIVE_COMMONS  [CREATIVE_COMMONS]

### Nets
3V3_EN [power]: R503.P$2 U502.4(EN2) U502.5(EN1) ; also sheet 1
!VDD_5V_HIPOWER_OC: R502.P$1 U501.4(!FAULT) ; also sheet 1
!VDD_5V_PERIPH_EN: R506.P$1 U501.5(!CE) U503.5(!CE) ; also sheet 1
!VDD_5V_PERIPH_OC: R507.P$1 U503.4(!FAULT) ; also sheet 1
BBB-VDD_3V3 [power]: C505.P$1 C506.P$1 C507.P$1 R502.P$2 R507.P$2 U502.7(VOUT2) ; also sheet 2,3,6,7,9
FMU-VDD_5V5 [power]: C501.P$1 C502.P$1 L501.P$2 U502.1(VIN)
GND [power]: C501.P$2 C502.P$2 C503.P$1 C504.P$2 C505.P$2 C506.P$2 C507.P$2 C508.P$2 C509.P$2 C510.P$2 L501.P$3 L501.P$4 L501.P$5 R501.P$2 R504.P$2 R505.1 R506.P$2 R509.P$2 U501.2(VSS) U501.6(VBAT) U501.GND(VSS) U501.P$2(VSS) U501.P$3(VSS) U502.2(GND) U502.GND U503.2(VSS) U503.6(VBAT) U503.GND(VSS) U503.P$2(VSS) U503.P$3(VSS) ; also sheet 1,2,3,4,6,7,8,9
N$11: C503.P$2 U502.6(CSET)
N$34: R504.P$1 U503.7(ILIM)
N$80: Q501.C R505.2
N$81: Q501.B R503.P$1
N$96: R501.P$1 U501.7(ILIM)
SYS_5V: L501.P$1 R508.P$2 U501.1(IN) U503.1(IN) ; also sheet 1,7,8,9
VDD_3V3_SENSORS [power]: C508.P$1 C509.P$1 Q501.E U502.8(VOUT1) ; also sheet 1,3,4,9
VDD_5V_HIPOWER [power]: C504.P$1 U501.8(OUT) ; also sheet 2
VDD_5V_PERIPH [power]: C510.P$1 U503.8(OUT) ; also sheet 2,3,6
VDD_5V_SENS: R508.P$1 R509.P$1 ; also sheet 1
Unconnected: U502.3(POR2)

### Notes on the sheet
- Note: Maximise copper area connected 
  to center ground pad.
- POR reset 
  delay 1s / uF
- Current Limits:
  I(limit) = 25000 / R(ilim)
  25K = 1A, 16K5 = 1.5A
- Drain resistor for 
  Sensor Power Rail
- Direct cloning is NOT desired, but if you do....
  please follow the spirit of OSHW, do not try and hide the fact that they are clones, do not expect that your cloned boards will interoperate with software designed for the original boards.
  
  for use in a flying vehicle, ensure that you have complied with any requirements found on Ardupilot.com in preparing the Certificate of Authenticity that will reside on the SHA chip on the board.
  
  if you make a clone or derivative of this board, you must release your exact schematics and PCB doccuments, and include these notices on every page.
- BBB Power and Reset
- Philip Rowse, 3D Robotics, Lorenz Meiers, and the PX4 team

## Sheet 6 of 9
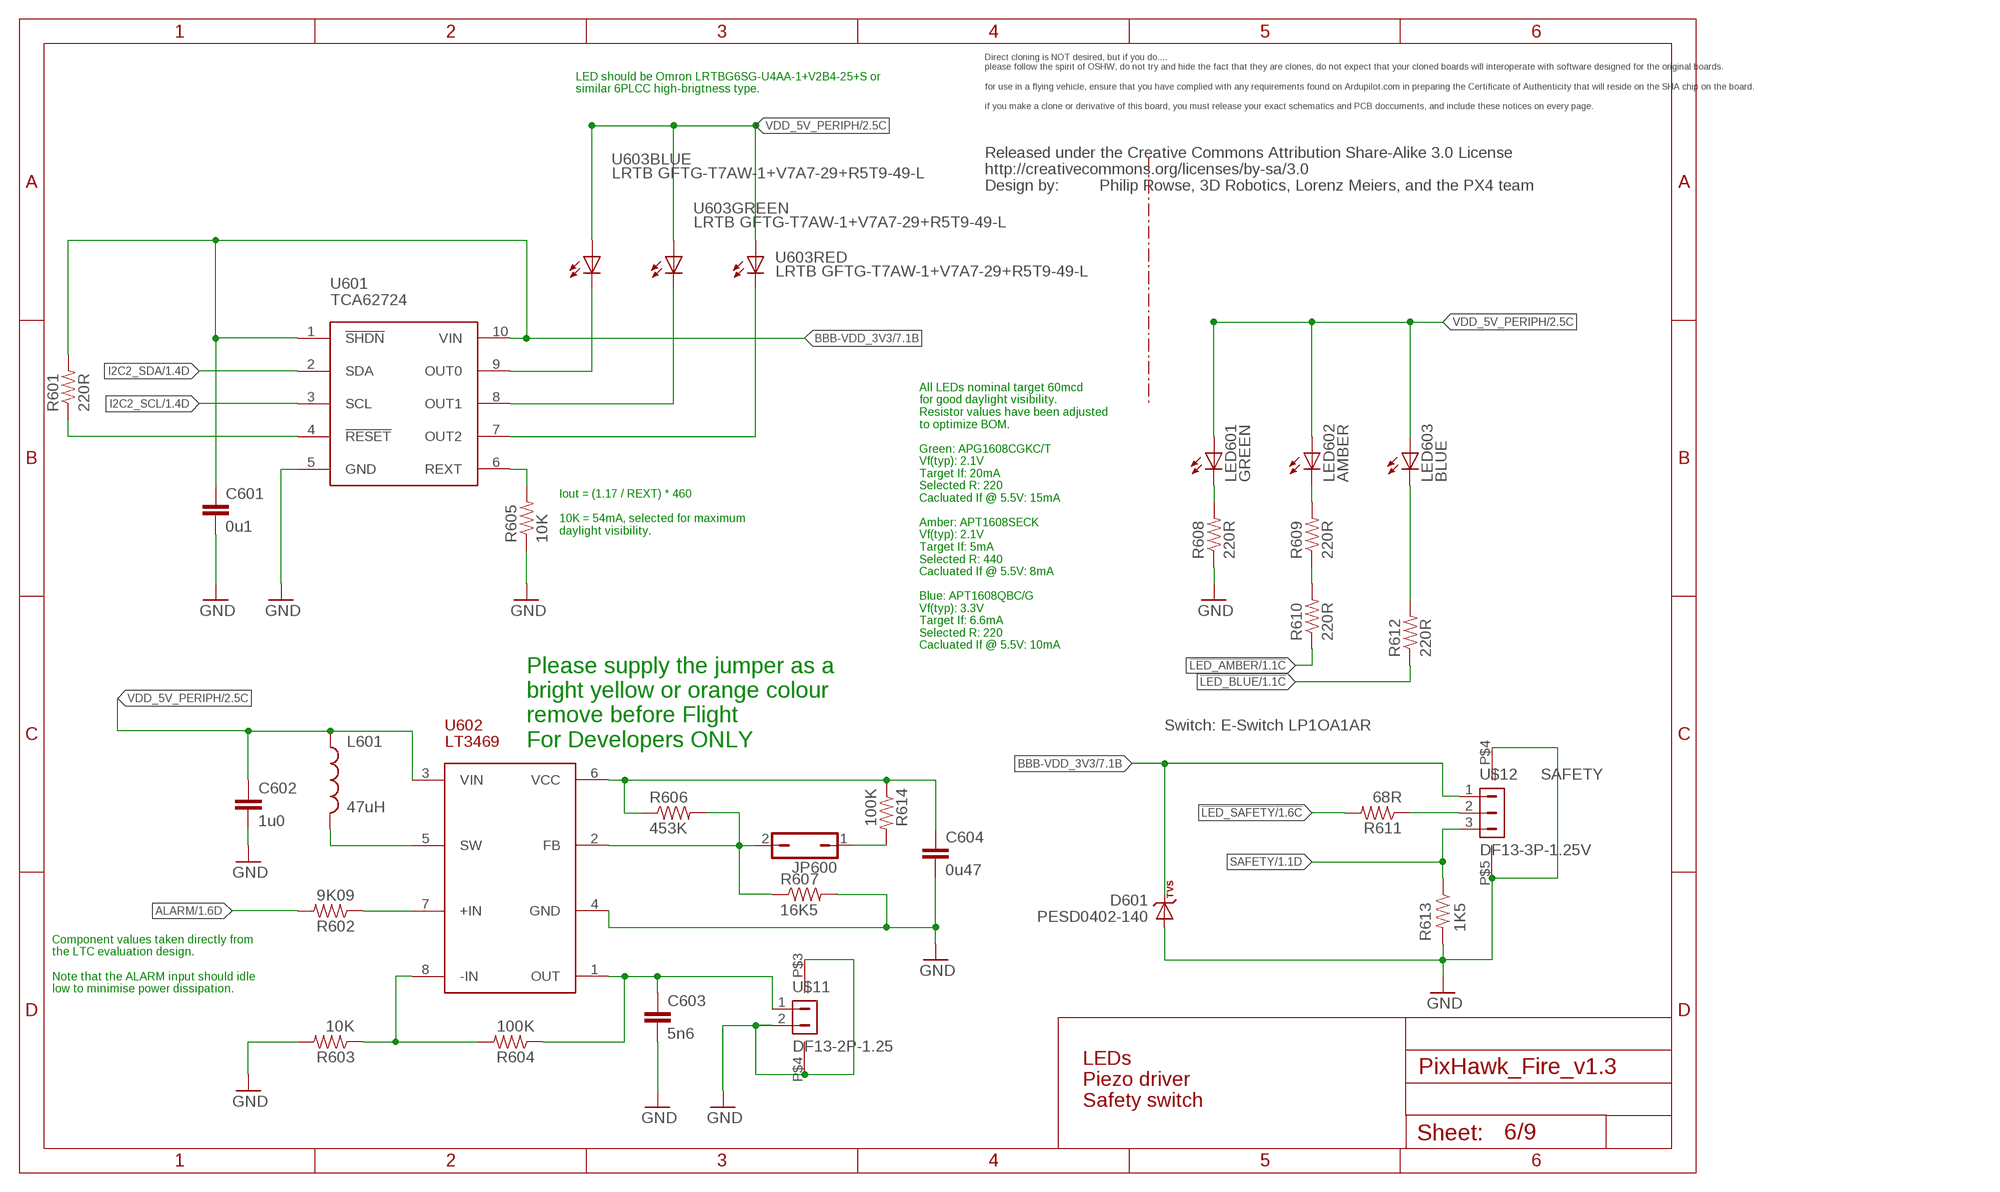
[diagram p5: schematic, sheet 6]

### Parts
C601  0u1  CAP0402  [0402-CAP]
C602  1u0  CAP0603  [0603-CAP]
C603  5n6  CAP0402  [0402-CAP]
C604  0u47  CAP0402  [0402-CAP]
D601  PESD0402-140  DIODE-TVS  [0402-TVS]
JP600  JP1Q  [JP1]
L601  47uH  INDUCTOR0805  [0805-IND]
LED601  GREEN  LED0603  [0603-LED]
LED602  AMBER  LED0603  [0603-LED]
LED603  BLUE  LED0603  [0603-LED]
R601  220R  RESISTOR0402-RES  [0402-RES]
R602  9K09  RESISTOR0402-RES  [0402-RES]
R603  10K  RESISTOR0402-RES  [0402-RES]
R604  100K  RESISTOR0402-RES  [0402-RES]
R605  10K  RESISTOR0402-RES  [0402-RES]
R606  453K  RESISTOR0402-RES  [0402-RES]
R607  16K5  RESISTOR0402-RES  [0402-RES]
R608  220R  RESISTOR0402-RES  [0402-RES]
R609  220R  RESISTOR0402-RES  [0402-RES]
R610  220R  RESISTOR0402-RES  [0402-RES]
R611  68R  RESISTOR0402-RES  [0402-RES]
R612  220R  RESISTOR0402-RES  [0402-RES]
R613  1K5  RESISTOR0402-RES  [0402-RES]
R614  100K  RESISTOR0402-RES  [0402-RES]
U601  TCA62724FMG  [SON10]
U602  LT3469  [SOT23-8]
U603  LRTB GFTG-T7AW-1+V7A7-29+R5T9-49-L  RGB-LED6-PLCC  [6-PLCC]
U$10  CREATIVE_COMMONS  [CREATIVE_COMMONS]
U$11  DF13-2P-1.25  [DF13C-2P-1.25V]
U$12  DF13-3P-1.25V  [DF13C-3P-1.25V]

### Nets
!LED_AMBER: R610.P$1 ; also sheet 1
!LED_BLUE: R612.P$1 ; also sheet 1
!LED_SAFETY: R611.P$2 ; also sheet 1
ALARM: R602.P$2 ; also sheet 1
BBB-VDD_3V3 [power]: C601.P$1 D601.C R601.P$2 U601.1(!SHDN) U601.10(VIN) U$12.1 ; also sheet 2,3,5,7,9
GND [power]: C601.P$2 C602.P$2 C603.P$2 C604.P$2 D601.A R603.P$2 R605.P$1 R607.P$2 R608.P$1 R613.P$2 U601.5(GND) U602.4(GND) U$11.2 U$11.P$3 U$11.P$4 U$12.P$4 U$12.P$5 ; also sheet 1,2,3,4,5,7,8,9
I2C2_SCL: U601.3(SCL) ; also sheet 1,3,4
I2C2_SDA: U601.2(SDA) ; also sheet 1,3,4
N$1: R601.P$1 U601.4(!RESET)
N$9: LED603.C R612.P$2
N$24: JP600.2 R606.P$2 R607.P$1 U602.2(FB)
N$25: R603.P$1 R604.P$2 U602.8(-IN)
N$27: C603.P$1 R604.P$1 U602.1(OUT) U$11.1
N$28: R602.P$1 U602.7(+IN)
N$29: LED601.C R608.P$2
N$32: L601.P$2 U602.5(SW)
N$36: C604.P$1 R606.P$1 R614.P$1 U602.6(VCC)
N$39: R609.P$1 R610.P$2
N$40: LED602.C R609.P$2
N$56: JP600.1 R614.P$2
N$57: R611.P$1 U$12.2
N$95: R605.P$2 U601.6(REXT)
RGB_LED_3: U601.9(OUT0) U603.C1(BLUE:C)
RGB_LED_4: U601.8(OUT1) U603.C2(GREEN:C)
RGB_LED_14: U601.7(OUT2) U603.C3(RED:C)
SAFETY: R613.P$1 U$12.3 ; also sheet 1
VDD_5V_PERIPH [power]: C602.P$1 L601.P$1 LED601.A LED602.A LED603.A U602.3(VIN) U603.A1(BLUE:A) U603.A2(GREEN:A) U603.A3(RED:A) ; also sheet 2,3,5

### Notes on the sheet
- LED should be Omron LRTBG6SG-U4AA-1+V2B4-25+S or 
  similar 6PLCC high-brigtness type.
- Direct cloning is NOT desired, but if you do....
  please follow the spirit of OSHW, do not try and hide the fact that they are clones, do not expect that your cloned boards will interoperate with software designed for the original boards.
  
  for use in a flying vehicle, ensure that you have complied with any requirements found on Ardupilot.com in preparing the Certificate of Authenticity that will reside on the SHA chip on the board.
  
  if you make a clone or derivative of this board, you must release your exact schematics and PCB doccuments, and include these notices on every page.
- Philip Rowse, 3D Robotics, Lorenz Meiers, and the PX4 team
- Iout = (1.17 / REXT) * 460
  
  10K = 54mA, selected for maximum
  daylight visibility.
- All LEDs nominal target 60mcd
  for good daylight visibility.
  Resistor values have been adjusted
  to optimize BOM.
  
  Green: APG1608CGKC/T
  Vf(typ): 2.1V
  Target If: 20mA
  Selected R: 220
  Cacluated If @ 5.5V: 15mA
  
  Amber: APT1608SECK
  Vf(typ): 2.1V
  Target If: 5mA
  Selected R: 440
  Cacluated If @ 5.5V: 8mA
  
  Blue: APT1608QBC/G
  Vf(typ): 3.3V
  Target If: 6.6mA
  Selected R: 220
  Cacluated If @ 5.5V: 10mA
- Switch: E-Switch LP1OA1AR
- Please supply the jumper as a
  bright yellow or orange colour
  remove before Flight
  For Developers ONLY
- SAFETY
- Component values taken directly from
  the LTC evaluation design.
  
  Note that the ALARM input should idle
  low to minimise power dissipation.
- LEDs
  Piezo driver
  Safety switch

## Sheet 7 of 9
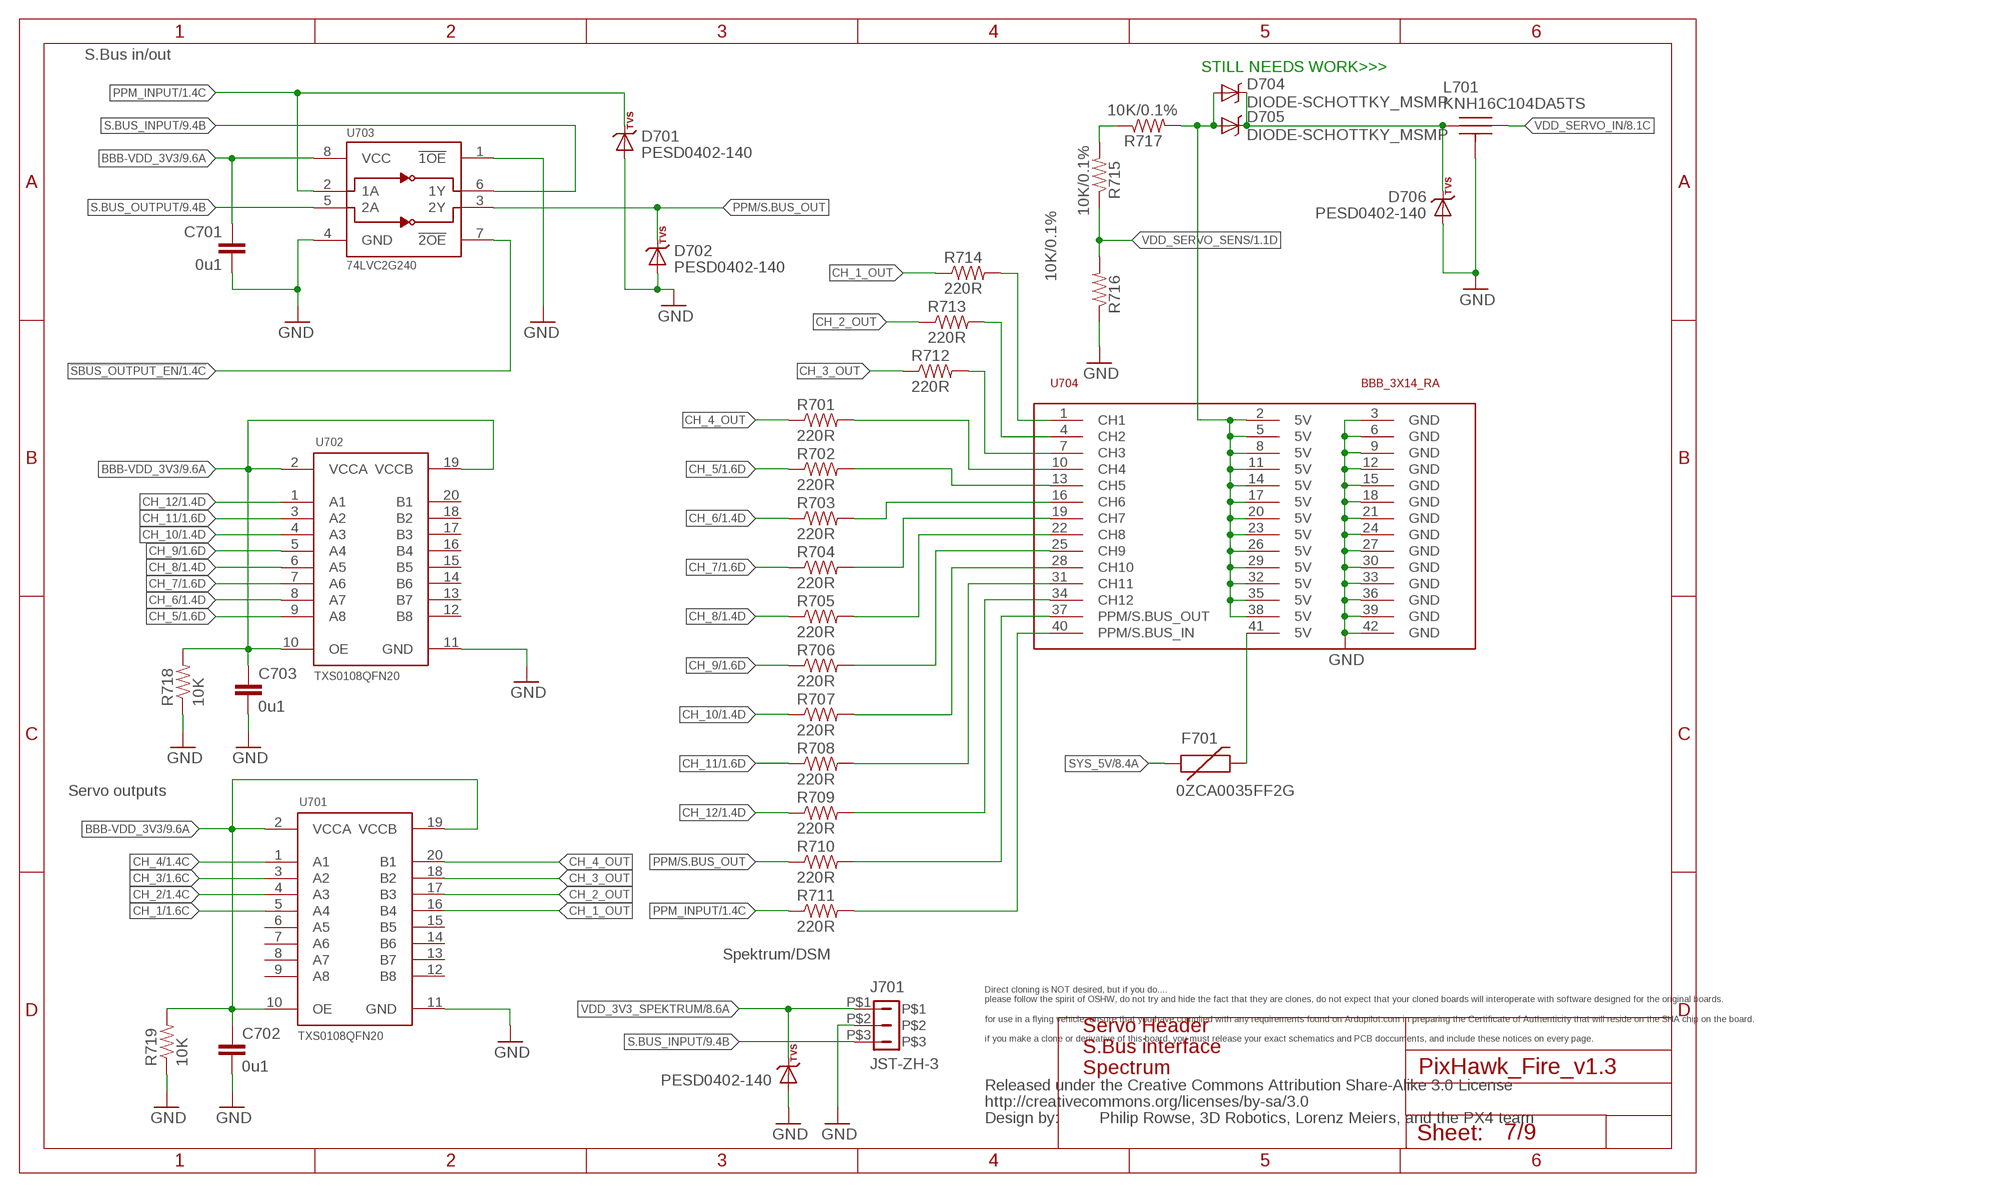
[diagram p6: schematic, sheet 7]

### Parts
C701  0u1  CAP0402  [0402-CAP]
C702  0u1  CAP0402  [0402-CAP]
C703  0u1  CAP0402  [0402-CAP]
D701  PESD0402-140  DIODE-TVS  [0402-TVS]
D702  PESD0402-140  DIODE-TVS  [0402-TVS]
D703  PESD0402-140  DIODE-TVS  [0402-TVS]
D704  DIODE-SCHOTTKY_MSMP  [MICROSMP]
D705  DIODE-SCHOTTKY_MSMP  [MICROSMP]
D706  PESD0402-140  DIODE-TVS  [0402-TVS]
F701  0ZCA0035FF2G  PTCSMD  [PTC-1206]
J701  JST-ZH-3  [JST-ZH-SMT-VERTICAL]
L701  KNH16C104DA5TS  [KYOCERA-KNH16-DA]
R701  220R  RESISTOR0402-RES  [0402-RES]
R702  220R  RESISTOR0402-RES  [0402-RES]
R703  220R  RESISTOR0402-RES  [0402-RES]
R704  220R  RESISTOR0402-RES  [0402-RES]
R705  220R  RESISTOR0402-RES  [0402-RES]
R706  220R  RESISTOR0402-RES  [0402-RES]
R707  220R  RESISTOR0402-RES  [0402-RES]
R708  220R  RESISTOR0402-RES  [0402-RES]
R709  220R  RESISTOR0402-RES  [0402-RES]
R710  220R  RESISTOR0402-RES  [0402-RES]
R711  220R  RESISTOR0402-RES  [0402-RES]
R712  220R  RESISTOR0402-RES  [0402-RES]
R713  220R  RESISTOR0402-RES  [0402-RES]
R714  220R  RESISTOR0402-RES  [0402-RES]
R715  10K/0.1%  RESISTOR0402-RES  [0402-RES]
R716  10K/0.1%  RESISTOR0402-RES  [0402-RES]
R717  10K/0.1%  RESISTOR0402-RES  [0402-RES]
R718  10K  RESISTOR0402-RES  [0402-RES]
R719  10K  RESISTOR0402-RES  [0402-RES]
U701  TXS0108QFN20  [QFN20-RGY]
U702  TXS0108QFN20  [QFN20-RGY]
U703  74LVC2G240  74LVC2G240-TSSOP-8  [TSSOP8_SOT505-2]
U704  BBB_3X14_RA  [3X14RA]
U$13  CREATIVE_COMMONS  [CREATIVE_COMMONS]

### Nets
!SBUS_OUTPUT_EN: U703.7(!2OE) ; also sheet 1
BBB-VDD_3V3 [power]: C701.P$1 C702.P$1 C703.P$1 R718.P$2 R719.P$2 U701.2(VCCA) U701.10(OE) U701.19(VCCB) U702.2(VCCA) U702.10(OE) U702.19(VCCB) U703.8(VCC) ; also sheet 2,3,5,6,9
CH_1: U701.5(A4) ; also sheet 1
CH_1_OUT: R714.P$1 U701.16(B4)
CH_2: U701.4(A3) ; also sheet 1
CH_2_OUT: R713.P$1 U701.17(B3)
CH_3: U701.3(A2) ; also sheet 1
CH_3_OUT: R712.P$1 U701.18(B2)
CH_4: U701.1(A1) ; also sheet 1
CH_4_OUT: R701.P$1 U701.20(B1)
CH_5: R702.P$1 U702.9(A8) ; also sheet 1
CH_6: R703.P$1 U702.8(A7) ; also sheet 1
CH_7: R704.P$1 U702.7(A6) ; also sheet 1
CH_8: R705.P$1 U702.6(A5) ; also sheet 1
CH_9: R706.P$1 U702.5(A4) ; also sheet 1
CH_10: R707.P$1 U702.4(A3) ; also sheet 1
CH_11: R708.P$1 U702.3(A2) ; also sheet 1
CH_12: R709.P$1 U702.1(A1) ; also sheet 1
FMU-CH6-PROT: R708.P$2 U704.31(CH11)
GND [power]: C701.P$2 C702.P$2 C703.P$2 D701.A D702.A D703.A D706.A J701.P$2 L701.P$3 L701.P$4 L701.P$5 R716.P$1 R718.P$1 R719.P$1 U701.11(GND) U702.11(GND) U703.1(!1OE) U703.4(GND) U704.3(GND) U704.6(GND) U704.9(GND) U704.12(GND) U704.15(GND) U704.18(GND) U704.21(GND) U704.24(GND) U704.27(GND) U704.30(GND) U704.33(GND) U704.36(GND) U704.39(GND) U704.42(GND) ; also sheet 1,2,3,4,5,6,8,9
IO-CH1-PROT: R707.P$2 U704.28(CH10)
IO-CH8-PROT: R712.P$2 U704.7(CH3)
N$3: R715.P$2 R717.P$1
N$10 [power]: D704.CATHODE(C) D705.CATHODE(C) D706.C L701.P$1
N$12 [power]: D704.ANODE(A) D705.ANODE(A) R717.P$2 U704.2(5V) U704.5(5V) U704.8(5V) U704.11(5V) U704.14(5V) U704.17(5V) U704.20(5V) U704.23(5V) U704.26(5V) U704.29(5V) U704.32(5V) U704.35(5V) U704.38(5V)
N$13: F701.2 U704.41(5V)
N$31: R701.P$2 U704.10(CH4)
N$68: R709.P$2 U704.34(CH12)
N$71: R702.P$2 U704.13(CH5)
N$72: R703.P$2 U704.16(CH6)
N$73: R704.P$2 U704.19(CH7)
N$74: R705.P$2 U704.22(CH8)
N$75: R706.P$2 U704.25(CH9)
N$77: R710.P$2 U704.37(PPM/S.BUS_OUT)
N$78: R711.P$2 U704.40(PPM/S.BUS_IN)
N$99: R713.P$2 U704.4(CH2)
PPM-SBUS-PROT: R714.P$2 U704.1(CH1)
PPM/S.BUS_OUT: D702.C R710.P$1 U703.3(2Y)
PPM_INPUT: D701.C R711.P$1 U703.2(1A) ; also sheet 1
S.BUS_INPUT: J701.P$3 U703.6(1Y) ; also sheet 2,9
S.BUS_OUTPUT: U703.5(2A) ; also sheet 2,9
SYS_5V: F701.1 ; also sheet 1,5,8,9
VDD_3V3_SPEKTRUM [power]: D703.C J701.P$1 ; also sheet 8
VDD_SERVO_IN [power]: L701.P$2 ; also sheet 8
VDD_SERVO_SENS: R715.P$1 R716.P$2 ; also sheet 1
Unconnected: U701.6(A5) U701.7(A6) U701.8(A7) U701.9(A8) U701.12(B8) U701.13(B7) U701.14(B6) U701.15(B5) U702.12(B8) U702.13(B7) U702.14(B6) U702.15(B5) U702.16(B4) U702.17(B3) U702.18(B2) U702.20(B1)

### Notes on the sheet
- S.Bus in/out
- STILL NEEDS WORK>>>
- Servo outputs
- Spektrum/DSM
- Direct cloning is NOT desired, but if you do....
  please follow the spirit of OSHW, do not try and hide the fact that they are clones, do not expect that your cloned boards will interoperate with software designed for the original boards.
  
  for use in a flying vehicle, ensure that you have complied with any requirements found on Ardupilot.com in preparing the Certificate of Authenticity that will reside on the SHA chip on the board.
  
  if you make a clone or derivative of this board, you must release your exact schematics and PCB doccuments, and include these notices on every page.
- Servo Header
  S.Bus interface
  Spectrum
- Philip Rowse, 3D Robotics, Lorenz Meiers, and the PX4 team

## Sheet 8 of 9
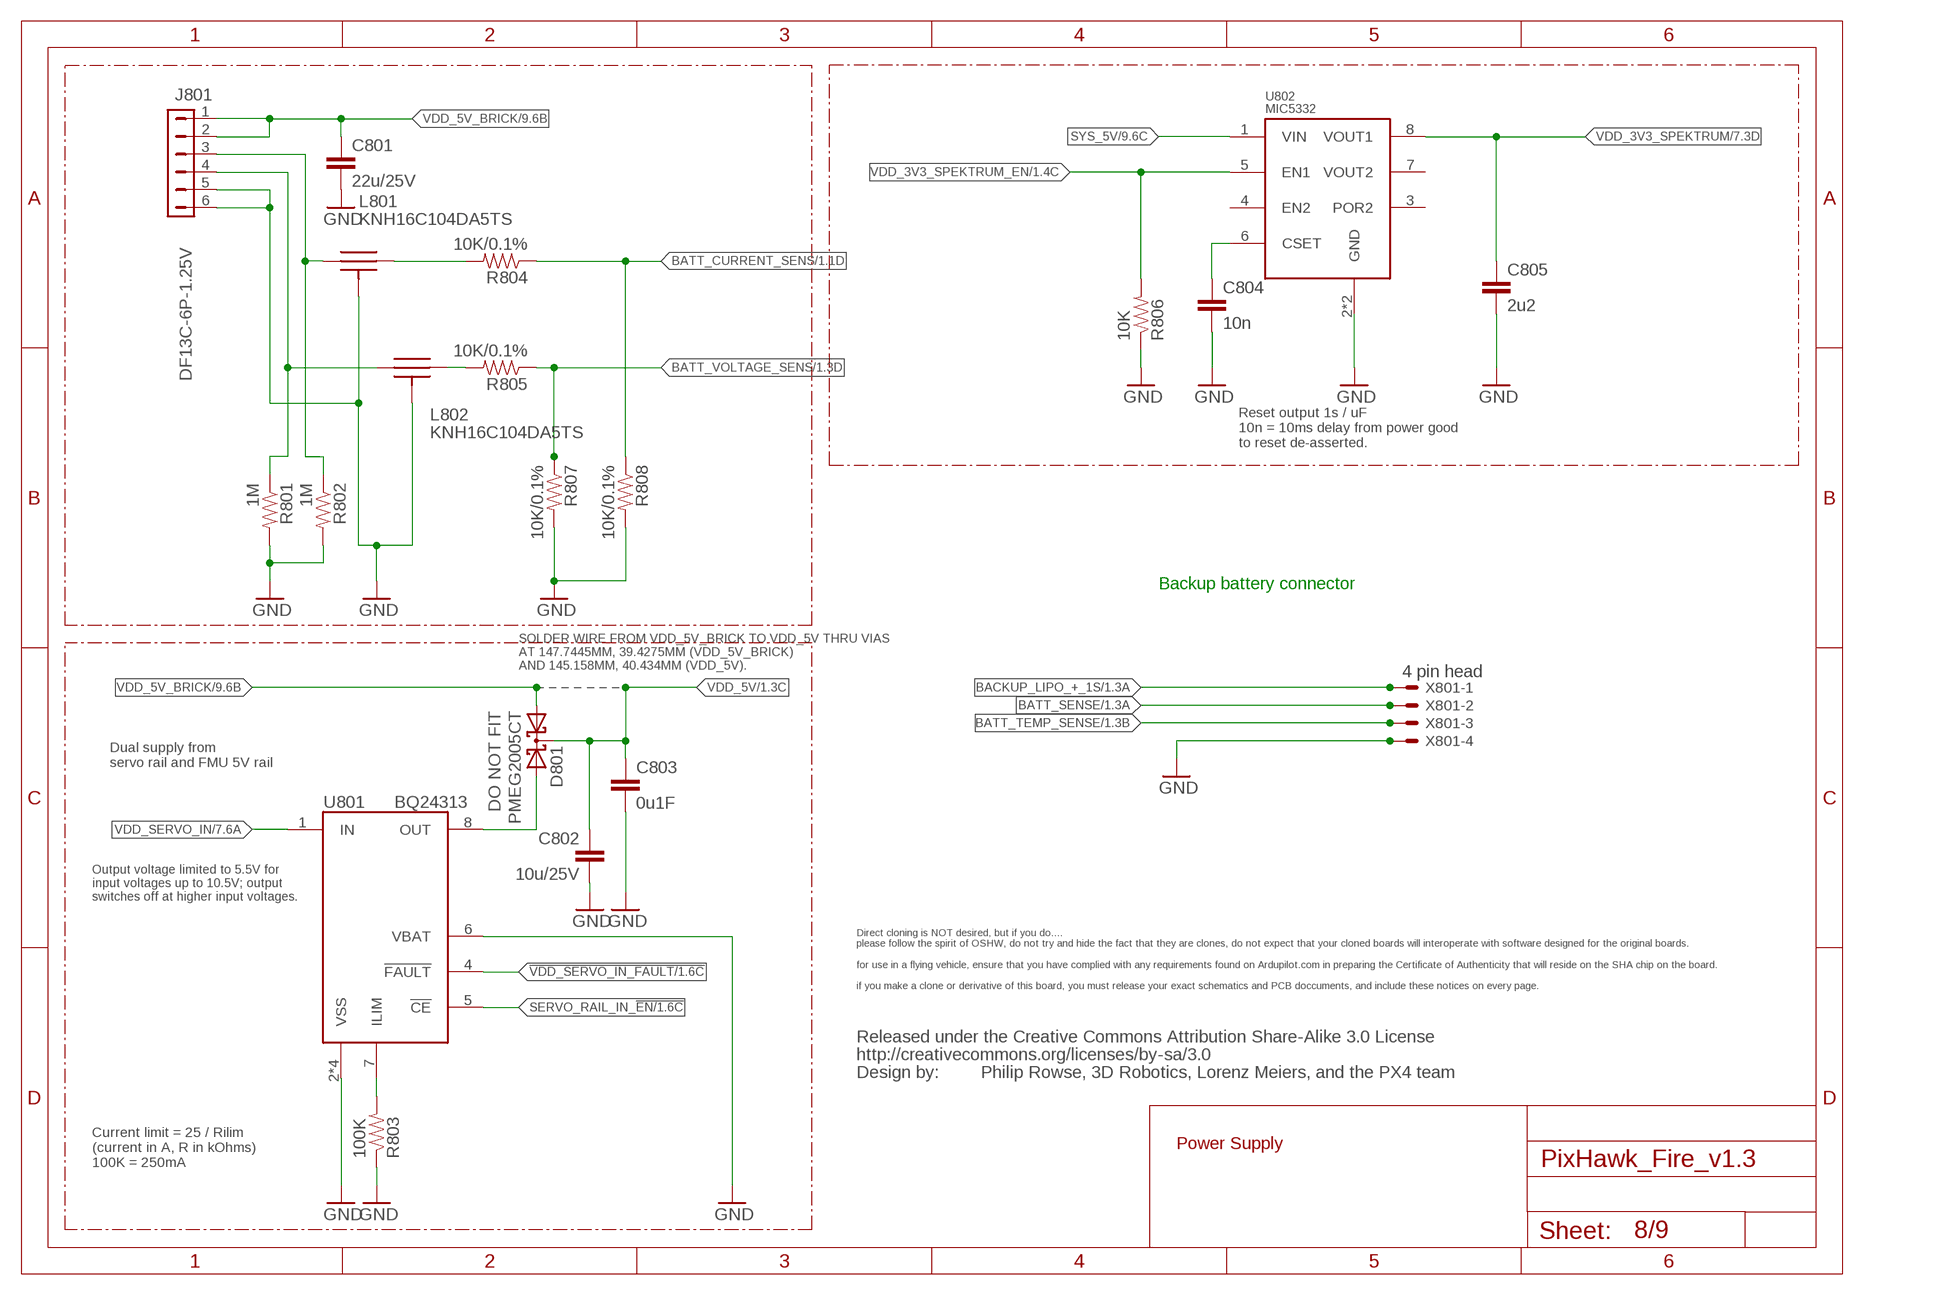
[diagram p7: schematic, sheet 8]

### Parts
C801  22u/25V  CAP0805  [0805-CAP]
C802  10u/25V  CAP0805  [0805-CAP]
C803  0u1F  CAP0402  [0402-CAP]
C804  10n  CAP0402  [0402-CAP]
C805  2u2  CAP0402  [0402-CAP]
D801  PMEG2005CT  [SOT23-3]
J801  DF13C-6P-1.25V  DF13-6P-1.25V  [DF13C-6P-1.25V]
L801  KNH16C104DA5TS  [KYOCERA-KNH16-DA]
L802  KNH16C104DA5TS  [KYOCERA-KNH16-DA]
R801  1M  RESISTOR0402-RES  [0402-RES]
R802  1M  RESISTOR0402-RES  [0402-RES]
R803  100K  RESISTOR0402-RES  [0402-RES]
R804  10K/0.1%  RESISTOR0402-RES  [0402-RES]
R805  10K/0.1%  RESISTOR0402-RES  [0402-RES]
R806  10K  RESISTOR0402-RES  [0402-RES]
R807  10K/0.1%  RESISTOR0402-RES  [0402-RES]
R808  10K/0.1%  RESISTOR0402-RES  [0402-RES]
U801  BQ24313  [QFN8-DSG]
U802  MIC5332  [MLF-8-EPAD]
U$14  CREATIVE_COMMONS  [CREATIVE_COMMONS]
X801  4 pin head  53047-04  [53047-04]

### Nets
!VDD_SERVO_IN_FAULT: U801.4(!FAULT) ; also sheet 1
BACKUP_LIPO_+_1S: X801.1 ; also sheet 1
BATT_CURRENT_SENS: R804.P$1 R808.P$1 ; also sheet 1
BATT_CURRENT_SENS_PROT: J801.3 L801.P$1 R802.P$1
BATT_SENSE: X801.2 ; also sheet 1
BATT_TEMP_SENSE: X801.3 ; also sheet 1
BATT_VOLTAGE_SENS: R805.P$1 R807.P$1 ; also sheet 1
BATT_VOLTAGE_SENS_PROT: J801.4 L802.P$1 R801.P$1
GND [power]: C801.P$2 C802.P$2 C803.P$2 C804.P$2 C805.P$2 J801.5 J801.6 L801.P$3 L801.P$4 L801.P$5 L802.P$3 L802.P$4 L802.P$5 R801.P$2 R802.P$2 R803.P$1 R806.P$1 R807.P$2 R808.P$2 U801.2(VSS) U801.6(VBAT) U801.GND(VSS) U801.P$2(VSS) U801.P$3(VSS) U802.2(GND) U802.GND X801.4 ; also sheet 1,2,3,4,5,6,7,9
N$4 [power]: D801.2(A2) U801.8(OUT)
N$20: R803.P$2 U801.7(ILIM)
N$102: L802.P$2 R805.P$2
N$103: L801.P$2 R804.P$2
N$104: C804.P$1 U802.6(CSET)
SERVO_RAIL_IN_!EN: U801.5(!CE) ; also sheet 1
SYS_5V: U802.1(VIN) ; also sheet 1,5,7,9
VDD_3V3_SPEKTRUM [power]: C805.P$1 U802.8(VOUT1) ; also sheet 7
VDD_3V3_SPEKTRUM_EN: R806.P$2 U802.5(EN1) ; also sheet 1
VDD_5V: C802.P$1 C803.P$1 D801.3(CC) ; also sheet 1
VDD_5V_BRICK [power]: C801.P$1 D801.1(A1) J801.1 J801.2 ; also sheet 9
VDD_SERVO_IN [power]: U801.1(IN) ; also sheet 7
Unconnected: U802.3(POR2) U802.4(EN2) U802.7(VOUT2)

### Notes on the sheet
- Reset output 1s / uF
  10n = 10ms delay from power good
  to reset de-asserted.
- Backup battery connector
- SOLDER WIRE FROM VDD_5V_BRICK TO VDD_5V THRU VIAS 
  AT 147.7445MM, 39.4275MM (VDD_5V_BRICK) 
  AND 145.158MM, 40.434MM (VDD_5V).
- Dual supply from
  servo rail and FMU 5V rail
- Output voltage limited to 5.5V for
  input voltages up to 10.5V; output
  switches off at higher input voltages.
- Direct cloning is NOT desired, but if you do....
  please follow the spirit of OSHW, do not try and hide the fact that they are clones, do not expect that your cloned boards will interoperate with software designed for the original boards.
  
  for use in a flying vehicle, ensure that you have complied with any requirements found on Ardupilot.com in preparing the Certificate of Authenticity that will reside on the SHA chip on the board.
  
  if you make a clone or derivative of this board, you must release your exact schematics and PCB doccuments, and include these notices on every page.
- Philip Rowse, 3D Robotics, Lorenz Meiers, and the PX4 team
- Power Supply
- Current limit = 25 / Rilim
  (current in A, R in kOhms)
  100K = 250mA

## Sheet 9 of 9
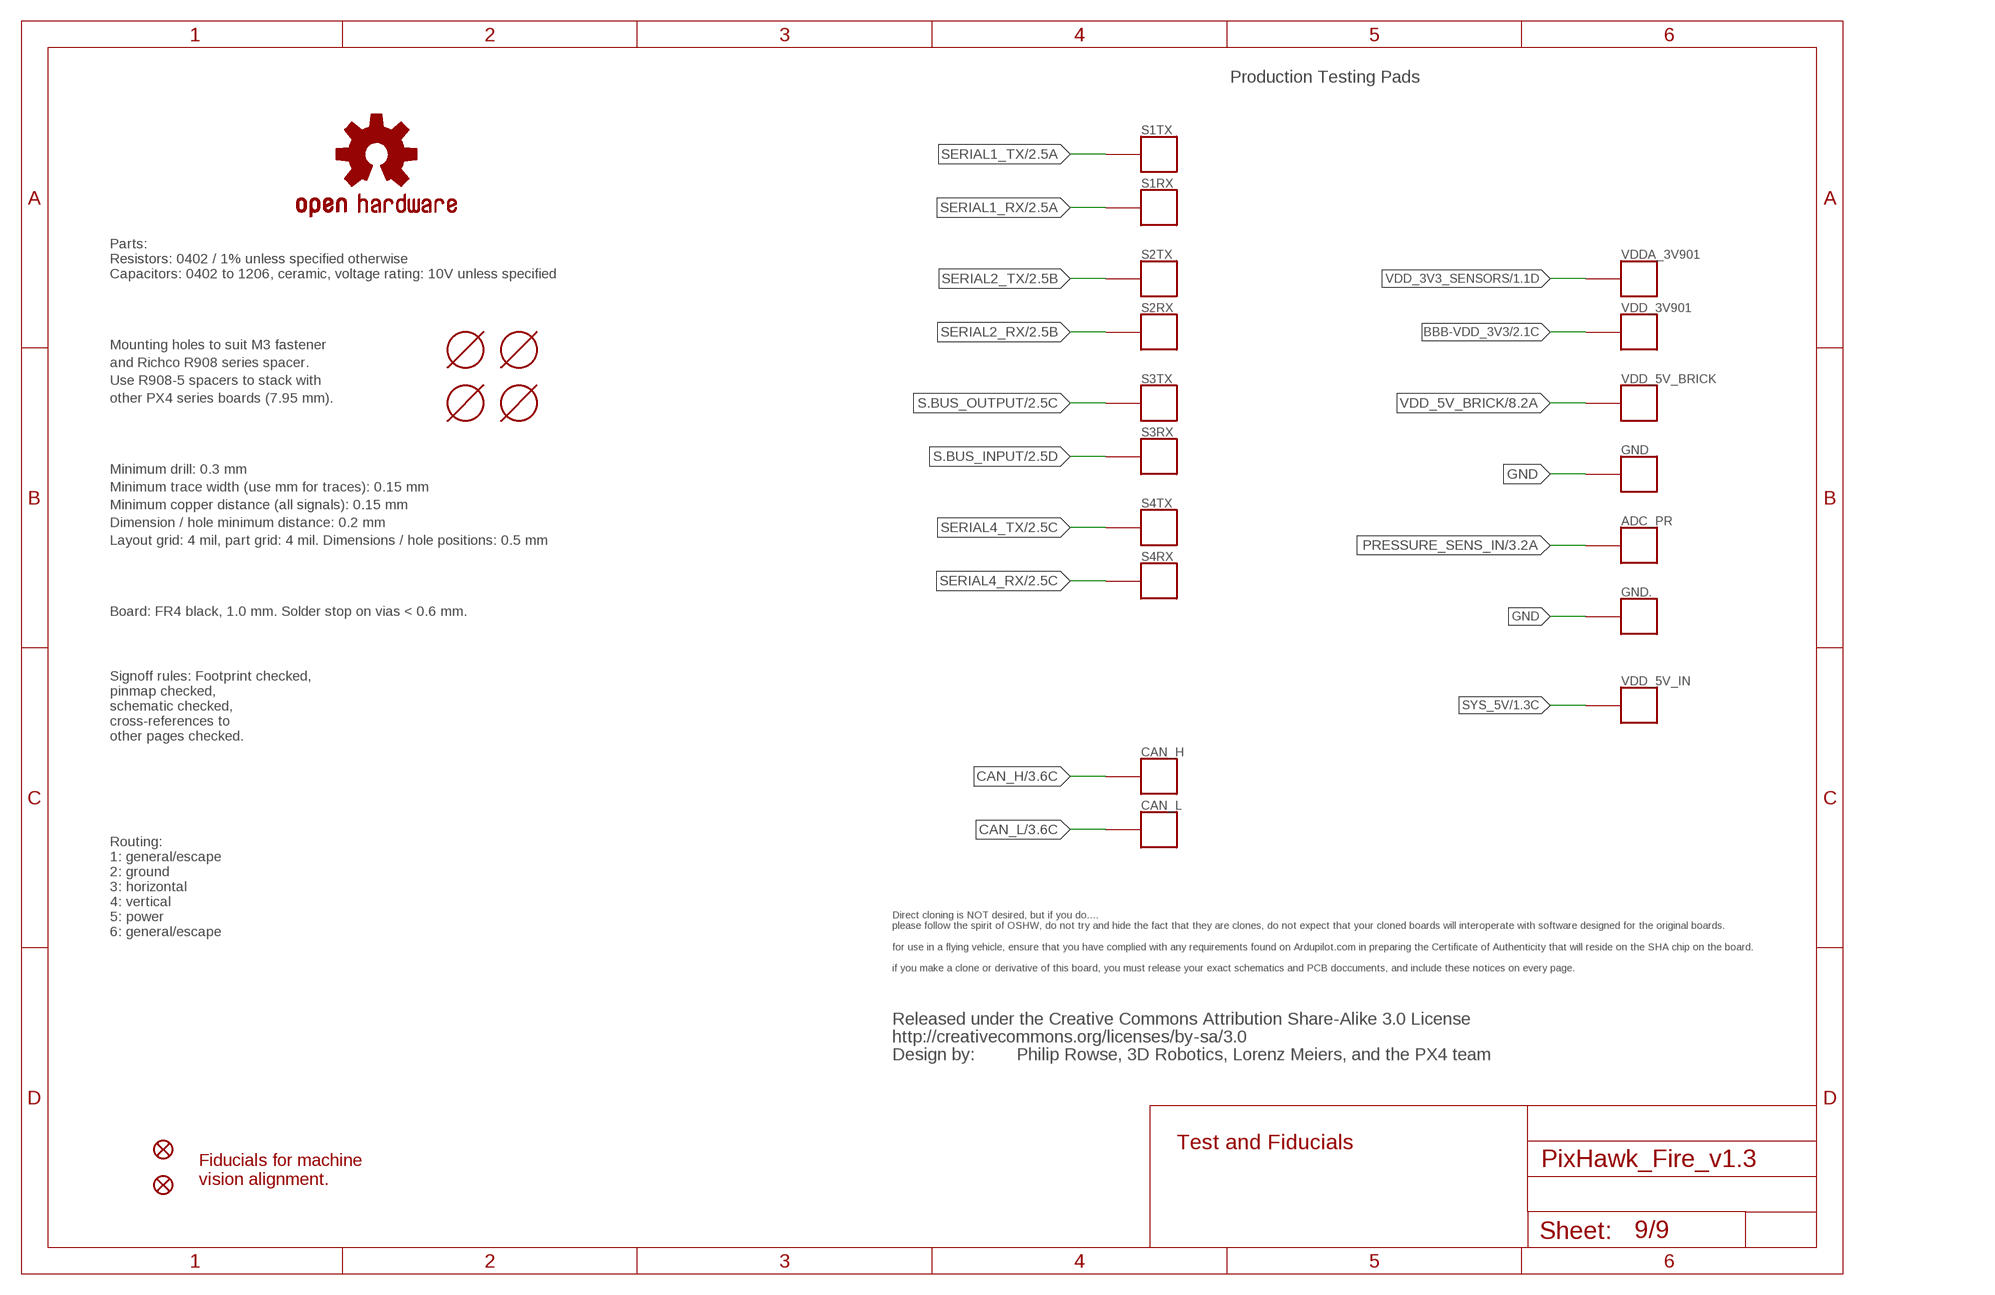
[diagram p8: schematic, sheet 9]

### Parts
ADC_PR  PAD.04  [PAD.04X.04]
CAN_H  PAD.04  [PAD.04X.04]
CAN_L  PAD.04  [PAD.04X.04]
GND  PAD.04  [PAD.04X.04]
GND.  PAD.04  [PAD.04X.04]
JP901  FIDUCIAL1.5X3  [FIDUCIAL-1.5X3]
JP902  FIDUCIAL1.5X3  [FIDUCIAL-1.5X3]
M3_MOUNT901  MOUNT-HOLE3.1MM  [MOUNT-HOLE3.1]
M3_MOUNT902  MOUNT-HOLE3.1MM  [MOUNT-HOLE3.1]
M3_MOUNT903  MOUNT-HOLE3.1MM  [MOUNT-HOLE3.1]
M3_MOUNT904  MOUNT-HOLE3.1MM  [MOUNT-HOLE3.1]
OSHW_LOGO  OSHW-LOGOS  [OSHW-LOGO-S]
S1RX  PAD.04  [PAD.04X.04]
S1TX  PAD.04  [PAD.04X.04]
S2RX  PAD.04  [PAD.04X.04]
S2TX  PAD.04  [PAD.04X.04]
S3RX  PAD.04  [PAD.04X.04]
S3TX  PAD.04  [PAD.04X.04]
S4RX  PAD.04  [PAD.04X.04]
S4TX  PAD.04  [PAD.04X.04]
U$15  CREATIVE_COMMONS  [CREATIVE_COMMONS]
VDD_3V901  PAD.04  [PAD.04X.04]
VDD_5V_BRICK  PAD.04  [PAD.04X.04]
VDD_5V_IN  PAD.04  [PAD.04X.04]
VDDA_3V901  PAD.04  [PAD.04X.04]

### Nets
BBB-VDD_3V3 [power]: VDD_3V901.P$1 ; also sheet 2,3,5,6,7
CAN_H: CAN_H.P$1 ; also sheet 3
CAN_L: CAN_L.P$1 ; also sheet 3
GND [power]: GND..P$1 GND.P$1 ; also sheet 1,2,3,4,5,6,7,8
PRESSURE_SENS_IN: ADC_PR.P$1 ; also sheet 3
S.BUS_INPUT: S3RX.P$1 ; also sheet 2,7
S.BUS_OUTPUT: S3TX.P$1 ; also sheet 2,7
SERIAL1_RX: S1RX.P$1 ; also sheet 2
SERIAL1_TX: S1TX.P$1 ; also sheet 2
SERIAL2_RX: S2RX.P$1 ; also sheet 2
SERIAL2_TX: S2TX.P$1 ; also sheet 2
SERIAL4_RX: S4RX.P$1 ; also sheet 2
SERIAL4_TX: S4TX.P$1 ; also sheet 2
SYS_5V: VDD_5V_IN.P$1 ; also sheet 1,5,7,8
VDD_3V3_SENSORS [power]: VDDA_3V901.P$1 ; also sheet 1,3,4,5
VDD_5V_BRICK [power]: VDD_5V_BRICK.P$1 ; also sheet 8

### Notes on the sheet
- Production Testing Pads
- Parts:
  Resistors: 0402 / 1% unless specified otherwise
  Capacitors: 0402 to 1206, ceramic, voltage rating: 10V unless specified
- Mounting holes to suit M3 fastener
- and Richco R908 series spacer.
- Use R908-5 spacers to stack with
- other PX4 series boards (7.95 mm).
- Minimum drill: 0.3 mm
- Minimum trace width (use mm for traces): 0.15 mm
- Minimum copper distance (all signals): 0.15 mm
- Dimension / hole minimum distance: 0.2 mm
- Layout grid: 4 mil, part grid: 4 mil. Dimensions / hole positions: 0.5 mm
- Board: FR4 black, 1.0 mm. Solder stop on vias < 0.6 mm.
- Signoff rules: Footprint checked,
  pinmap checked,
  schematic checked, 
  cross-references to
  other pages checked.
- Routing:
  1: general/escape
  2: ground
  3: horizontal
  4: vertical
  5: power
  6: general/escape
- Direct cloning is NOT desired, but if you do....
  please follow the spirit of OSHW, do not try and hide the fact that they are clones, do not expect that your cloned boards will interoperate with software designed for the original boards.
  
  for use in a flying vehicle, ensure that you have complied with any requirements found on Ardupilot.com in preparing the Certificate of Authenticity that will reside on the SHA chip on the board.
  
  if you make a clone or derivative of this board, you must release your exact schematics and PCB doccuments, and include these notices on every page.
- Philip Rowse, 3D Robotics, Lorenz Meiers, and the PX4 team
- Test and Fiducials
- Fiducials for machine
  vision alignment.

## Power pins joined to a net without a drawn wire
3_VDD_3V3: U$101.49(3_VDD_3V3)

## Library data of the parts
ADC_PR CAN_H CAN_L GND GND. S1RX S1TX S2RX S2TX S3RX S3TX S4RX S4TX VDD_3V901 VDD_5V_BRICK VDD_5V_IN VDDA_3V901 = pixhawk2:PAD: Test pad This footprint includes three classes: The actual test pads, a pogo-pin footprint to mount the pogo-pin as through-hole part and a hole footprint which allows the head of the pogo-pin to pass through (do NOT use the hole to mount the pogo-pin). In a typical test setup, the stack would consist of three PCBs: The actual PCB under testing with a test pad on the bottom, then a second PCB with the hole for the pogo-pin head where the PCB under testing is pressed on and a third PCB at 30 mm / 1.2" distance with the pogo-pin footprints. The pogo-pins are soldered to the last PCB. To create the stack, copy the board under testing and exchange the footprints - this way the correct positioning is ensured.; BOM: EXCLUDE; PARTNO: *
C101 C201 C202 C301 C302 C304 C305 C401 C404 C408 C415 C501 C506 C508 C601 C701-C703 C803 = pixhawk2:CAP: Capacitor Standard 0603 ceramic capacitor, and 0.1" leaded capacitor.; PARTNO: CC0402ZRY5V7BB104
C303 C407 = pixhawk2:CAP: Capacitor Standard 0603 ceramic capacitor, and 0.1" leaded capacitor.; PARTNO: CC0805ZKY5V6BB106
C402 = pixhawk2:CAP: Capacitor Standard 0603 ceramic capacitor, and 0.1" leaded capacitor.; PARTNO: C1608X7S1A475K080AC
C403 = pixhawk2:CAP: Capacitor Standard 0603 ceramic capacitor, and 0.1" leaded capacitor.; PARTNO: CL10B224JP8NNNC
C405 = pixhawk2:CAP: Capacitor Standard 0603 ceramic capacitor, and 0.1" leaded capacitor.; PARTNO: CL10B104JO8NNNC
C406 C502 = pixhawk2:CAP: Capacitor Standard 0603 ceramic capacitor, and 0.1" leaded capacitor.; PARTNO: C1608X7S0J106M080AC
C409 C411 C414 C416 = pixhawk2:CAP: Capacitor Standard 0603 ceramic capacitor, and 0.1" leaded capacitor.; PARTNO: C0603C222J5RACTU
C410 = pixhawk2:CAP: Capacitor Standard 0603 ceramic capacitor, and 0.1" leaded capacitor.; PARTNO: C0603C103J5RAC7411
C412 = pixhawk2:CAP: Capacitor Standard 0603 ceramic capacitor, and 0.1" leaded capacitor.; BOM: EXCLUDE; PARTNO: CGA3E1X7R0J225K080AC
C413 = pixhawk2:CAP: Capacitor Standard 0603 ceramic capacitor, and 0.1" leaded capacitor.; BOM: EXCLUDE
C503 C804 = pixhawk2:CAP: Capacitor Standard 0603 ceramic capacitor, and 0.1" leaded capacitor.; PARTNO: CC0402KRX7R7BB103
C504 C510 = pixhawk2:CAP: Capacitor Standard 0603 ceramic capacitor, and 0.1" leaded capacitor.; PARTNO: C3216X5R1A107M160AC
C505 C602 = pixhawk2:CAP: Capacitor Standard 0603 ceramic capacitor, and 0.1" leaded capacitor.; PARTNO: CC0603ZRY5V7BB105
C507 C509 = pixhawk2:CAP: Capacitor Standard 0603 ceramic capacitor, and 0.1" leaded capacitor.; PARTNO: CC0805MKX5R5BB226
C603 = pixhawk2:CAP: Capacitor Standard 0603 ceramic capacitor, and 0.1" leaded capacitor.; PARTNO: CC0402KRX7R7BB562
C604 = pixhawk2:CAP: Capacitor Standard 0603 ceramic capacitor, and 0.1" leaded capacitor.; PARTNO: C1005X5R1C474K050BC
C801 = pixhawk2:CAP: Capacitor Standard 0603 ceramic capacitor, and 0.1" leaded capacitor.; PARTNO: CL21A226MAQNNNE
C802 = pixhawk2:CAP: Capacitor Standard 0603 ceramic capacitor, and 0.1" leaded capacitor.; PARTNO: CL21A106KAYNNNE
C805 = pixhawk2:CAP: Capacitor Standard 0603 ceramic capacitor, and 0.1" leaded capacitor.; PARTNO: CC0603ZRY5V6BB225
D201-D203 D301-D303 D601 D701-D703 D706 = pixhawk2:DIODE-TVS; PARTNO: PESD0402-140
D704 D705 = pixhawk2:DIODE-SCHOTTKY: Schottky barrier diode in DO214AC, e.g. Fairchild SS14.; PARTNO: SS14
D801 = pixhawk2:PMEG2005CT: 500 mA low VF dual MEGA Schottky barrier rectifier http://www.nxp.com/documents/data_sheet/PMEG2005CT.pdf; BOM: EXCLUDE; PARTNO: DO NOT FIT
F701 = pixhawk2:PTC: Resettable Fuse PTC Resettable Fuse. Spark Fun Electronics SKU : COM-08357; PARTNO: 0ZCA0035FF2G
FPC_401 = pixhawk2:CONN_FPC_10: 10-pin FPC connector for PX4 sensor board; PARTNO: 0512811094
J305 U$12 = pxf:DF13-3P-1.25: DF13-3P 1.25mm Pitch Miniature Crimping Connector.; PARTNO: DF13C-3P-1.25V(20)
J306-J308 J310 J314 = pxf:DF13-4P-1.25: DF13-4P 1.25mm Pitch Miniature Crimping Connector.; PARTNO: DF13C-4P-1.25V(20)
J309 = pxf:DF13-5P-1.25: DF13-5P 1.25mm Pitch Miniature Crimping Connector.; PARTNO: DF13C-5P-1.25V(20)
J701 = for-transfers:JST-ZH-3; PARTNO: B3B-ZR-SM4-TF (LF)(SN)(P)
J801 = con-hirose-df13:DF13-6P-1.25: DF13-6P 1.25mm Pitch Miniature Crimping Connector.; PARTNO: DF13C-6P-1.25V(20)
JP1 JP401 JP402 = pixhawk2:JUMPER-3; PARTNO: RC0603JR-070RL
JP600 = jumper:JP1Q: JUMPER; PARTNO: 1-87215-0
JP901 JP902 = pixhawk2:FIDUCIAL: Fiducial Alignment Points Various fiducial points for machine vision alignment.; BOM: EXCLUDE; PARTNO: *
L201-L203 L301-L303 L501 L701 L801 L802 = pixhawk2:KNH16C104DA5TS: Kyocera KNH16C104DA5TS EMI filter; PARTNO: KNH16C104DA5TS
L601 = pixhawk2:INDUCTOR: Inductors Basic Inductor/Choke - 0603 and 1210. Footprints are not proven and vary greatly between part numbers. SRR1210: Bourns SRR1210 parts, e.g. SRR1210-100M; PARTNO: MLZ2012M470W
LED601 = pixhawk2:LED: LEDs Standard schematic elements and footprints for 5mm, 3mm, 1206, and 0603 sized LEDs. 5mm - Spark Fun Electronics SKU : COM-00529 (and others); PARTNO: APTD1608CGCK
LED602 = pixhawk2:LED: LEDs Standard schematic elements and footprints for 5mm, 3mm, 1206, and 0603 sized LEDs. 5mm - Spark Fun Electronics SKU : COM-00529 (and others); PARTNO: APTD1608SECK
LED603 = pixhawk2:LED: LEDs Standard schematic elements and footprints for 5mm, 3mm, 1206, and 0603 sized LEDs. 5mm - Spark Fun Electronics SKU : COM-00529 (and others); PARTNO: APTD1608QBC/D
M3_MOUNT901-M3_MOUNT904 = pixhawk2:MOUNT-HOLE; BOM: EXCLUDE; PARTNO: *
OSHW_LOGO = pixhawk2:OSHW-LOGO: Open Source Hardware Logo This logo indicates the piece of hardware it is found on incorporates a OSHW license and/or adheres to the definition of open source hardware found here: http://freedomdefined.org/OSHW; BOM: EXCLUDE; PARTNO: *
Q501 = transistor-pnp:MMBT3906*: PNP Transistror; PARTNO: MMBT3906LT1G
R101 R315 = pixhawk2:RESISTOR: Resistor Basic schematic elements and footprints for 0603, 1206, and PTH 1/10th watt (small) resistors.; PARTNO: RC0402FR-070RL
R102 = pixhawk2:RESISTOR: Resistor Basic schematic elements and footprints for 0603, 1206, and PTH 1/10th watt (small) resistors.; PARTNO: RC0402FR-0710ML
R103 = pixhawk2:RESISTOR: Resistor Basic schematic elements and footprints for 0603, 1206, and PTH 1/10th watt (small) resistors.; PARTNO: RC0402FR-074K75L
R201-R214 R309 = pixhawk2:RESISTOR: Resistor Basic schematic elements and footprints for 0603, 1206, and PTH 1/10th watt (small) resistors.; PARTNO: RC0402FR-07120RL
R215 R216 R303 R306-R308 R310 R311 R314 R506 R508 R509 R603 R605 R715-R719 R804-R808 = pixhawk2:RESISTOR: Resistor Basic schematic elements and footprints for 0603, 1206, and PTH 1/10th watt (small) resistors.; PARTNO: ERA-2AEB103X
R301 R302 R304 R305 R613 = pixhawk2:RESISTOR: Resistor Basic schematic elements and footprints for 0603, 1206, and PTH 1/10th watt (small) resistors.; PARTNO: RC0402FR-071K5L
R312 R313 R601 R608-R610 R612 R701-R714 = pixhawk2:RESISTOR: Resistor Basic schematic elements and footprints for 0603, 1206, and PTH 1/10th watt (small) resistors.; PARTNO: RC0402FR-07220RL
R501 R607 = pixhawk2:RESISTOR: Resistor Basic schematic elements and footprints for 0603, 1206, and PTH 1/10th watt (small) resistors.; PARTNO: RMCF0402FT16K5
R502 R507 = pixhawk2:RESISTOR: Resistor Basic schematic elements and footprints for 0603, 1206, and PTH 1/10th watt (small) resistors.; PARTNO: MCR01MRTF1004
R503 = pixhawk2:RESISTOR: Resistor Basic schematic elements and footprints for 0603, 1206, and PTH 1/10th watt (small) resistors.; PARTNO: RC0402FR-071K8L
R504 = pixhawk2:RESISTOR: Resistor Basic schematic elements and footprints for 0603, 1206, and PTH 1/10th watt (small) resistors.; PARTNO: RMCF0402FT25K5
R505 = pixhawk2:RESISTOR: Resistor Basic schematic elements and footprints for 0603, 1206, and PTH 1/10th watt (small) resistors.; PARTNO: RC0402FR-0710RL
R602 = pixhawk2:RESISTOR: Resistor Basic schematic elements and footprints for 0603, 1206, and PTH 1/10th watt (small) resistors.; PARTNO: RMCF0402FT9K09
R604 R614 R803 = pixhawk2:RESISTOR: Resistor Basic schematic elements and footprints for 0603, 1206, and PTH 1/10th watt (small) resistors.; PARTNO: RC0402FR-07100KL
R606 = pixhawk2:RESISTOR: Resistor Basic schematic elements and footprints for 0603, 1206, and PTH 1/10th watt (small) resistors.; PARTNO: RMCF0402FT453K
R611 = pixhawk2:RESISTOR: Resistor Basic schematic elements and footprints for 0603, 1206, and PTH 1/10th watt (small) resistors.; PARTNO: RC0402FR-0768RL
R801 R802 = pixhawk2:RESISTOR: Resistor Basic schematic elements and footprints for 0603, 1206, and PTH 1/10th watt (small) resistors.; PARTNO: RC0402FR-071ML
U1 = pixhawk2:EEPROM-I2C: I2C EEPROM Generic footprint for I2C EEPROMS. Compatible types include: Microchip 24FC128-I/MS Microchip 24AA256-I/MS ST Microelectronics M24128-BWDW6TP; PARTNO: AT24CS32-SSHM
U2 = pixhawk2:EEPROM-I2C: I2C EEPROM Generic footprint for I2C EEPROMS. Compatible types include: Microchip 24FC128-I/MS Microchip 24AA256-I/MS ST Microelectronics M24128-BWDW6TP; PARTNO: ATSHA204-SH-DA-TTR-ND
U102 = pixhawk2:FM25V01: FM25V01 128Kb Serial 3V F-RAM Memory; DATASHEET: http://www.ramtron.com/files/datasheets/FM25V01_ds.pdf; LINK: http://www.digikey.com/product-detail/en/FM25V01-GTR/1140-1026-1-ND/2809832; MFGPN: FM25V01; PARTNO: FM25V01-G
U201 U202 U302 U701 U702 = pixhawk2:TXS0108; PARTNO: TXS0108ERGYR
U301 = pixhawk2:MAX3051: 3.3-V CAN TRANSCEIVER; PARTNO: MAX3051EKA
U303 = pixhawk2:PCA9306: http://www.nxp.com/documents/data_sheet/PCA9306.pdf PCA9306 I2C nevel shifter; PARTNO: PCA9306DQER
U401 U402 = pixhawk2:MS5611-01BA: MS5611-01BA The MS5611-01BA is a new generation of high resolution altimeter sensors from MEAS Switzerland with SPI and I 2 C bus interface. It is optimized for altimeters and variometers with an altitude resolution of 10 cm. The sensor module includes a high linearity pressure sensor and an ultra low power 24 bit ?? ADC with internal factory calibrated coefficients. It provides a precise digital 24 Bit pressure and temperature value and different operation modes that allow the user to optimize for conversion speed and current consumption. A high resolution temperature output allows the implementation of an altimeter/thermometer function without any additional sensor. The MS5611-01BA can be interfaced to virtually any microcontroller. The communication protocol is simple, without the need of programming internal registers in the device. Small dimensions of only 5.0 mm x 3.0 mm and a height of 1.7 mm allow for integration in mobile devices. This new sensor module generation is based on leading MEMS technology and latest benefits from MEAS Switzerland proven experience and know-how in high volume manufacturing of altimeter modules, which have been widely used for over a decade. The sensing principle employed leads to very low hysteresis and high stability of both pressure and temperature signal. High resolution module, 10 cm Fast conversion down to 1 ms Low power, 1 µA (standby < 0.15 µA) QFN package 5.0 x 3.0 x 1.7 mm3 Supply voltage 1.8 to 3.6 V Integrated digital pressure sensor (24 bit ?? ADC) Operating range: 10 to 1200 mbar, -40 to +85 °C I2C and SPI interface up to 20 MHz No external components (Internal oscillator) Excellent long term stability; DATASHEET: http://www.meas-spec.com/downloads/MS5611-01BA01.pdf; LINK: http://www.meas-spec.com/product/t_product.aspx?id=8503#; MFGPN: MS5611-01BA; PARTNO: MS5611-01BA
U403 = pixhawk2:MPU-6000: Invensense MPU-6000: 3-axis gyro, 3-axis accel & 9-axis MotionFusion The MPU-60X0 Motion Processing Unit (MPU?) is the world?s first motion processing solution with integrated 9-axis sensor fusion for handset and tablet applications, game controllers, motion pointer remote controls, and other consumer devices. The MPU-60X0 has an embedded 3-axis MEMS gyroscope, 3-axis MEMS accelerometer and Digital Motion Processor? (DMP) hardware accelerator engine with an auxiliary I 2 C port that interfaces to third party digital sensors, such as magnetometers. Interfacing with a 3-axis magnetometer delivers a complete 9-axis sensor fusion output to the MPU?s primary I 2 C or SPI port. (SPI is available on MPU-6000 only). This combines acceleration and rotational motion plus heading information into a single data stream for the application; DATASHEET: http://invensense.com/mems/gyro/documents/PS-MPU-6000A-00_v1.0.pdf; LINK: http://invensense.com/mems/gyro/mpu6000.html; MFGPN: MPU-6000; PARTNO: MPU-6000
U405 = pixhawk2:MPU-6500; PARTNO: MPU-9250
U406 = pixhawk2:LSM9DS0: LSM9DS0 Accel compass gyro; PARTNO: LSM9DS0TR
U407 = pixhawk2:BMP280_PRELIM; BOM: EXCLUDE; PARTNO: *
U501 U503 = pixhawk2:BQ24315; PARTNO: BQ24315DSGR
U502 U802 = pixhawk2:MIC5332; PARTNO: MIC5332-SSYMT
U601 = pixhawk2:TCA62724FMG: Toshiba TCA62724FMG I2C RGB LED driver; PARTNO: TCA62724FMG
U602 = pixhawk2:LT3469: LT3469 Piezo microactuator driver with boost regulator; PARTNO: LT3469ETS8
U603 = pixhawk2:RGB-LED: RGB LED with separate anode/cathode terminals; PARTNO: LRTB GFTG-T7AW-1+V7A7-29+R5T9-49-L
U703 = pixhawk2:74LVC2G240: Dual inverter tri-state, 3.3V/5V compatible http://www.nxp.com/documents/data_sheet/74LVC2G240.pdf http://focus.ti.com/lit/ds/symlink/sn74lvc2g240.pdf; PARTNO: 74LVC2G240DP,125
U704 = pixhawk2:BBB_3X14_RA; PARTNO: 07579
U801 = pixhawk2:BQ24313; PARTNO: BQ24313DSGT
U$1 = pixhawk2:PX4-LOGO; BOM: EXCLUDE
U$2-U$4 U$201 = pxf:DF13-6P-1.25: DF13-6P 1.25mm Pitch Miniature Crimping Connector.; PARTNO: DF13C-6P-1.25V(20)
U$5-U$10 U$13-U$15 = SparkFun:CREATIVE_COMMONS
U$11 = pxf:DF13-2P-1.25: DF13-2P 1.25mm Pitch Miniature Crimping Connector.; PARTNO: DF13C-2P-1.25V(20)
U$101 = pixhawk2:BEAGLEBONE_OUTLINE: Should match A3 pinout - but not completely tested; BOM: EXCLUDE
X801 = pixhawk2:53?-04: CONNECTOR wire to board 1.25 mm (.049 inch) pitch header; PARTNO: 53047-04

## Net classes
0 signal: width 0.127 mm, drill 0.2 mm, clearance 0.127 mm
1 power: width 0.127 mm, drill 0.2 mm, clearance 0.127 mm